# EAGLE design MBHP_CORE_LPC17v1.5.1 (EAGLE 6.5.0)

## Sheet 1 of 2: CORE
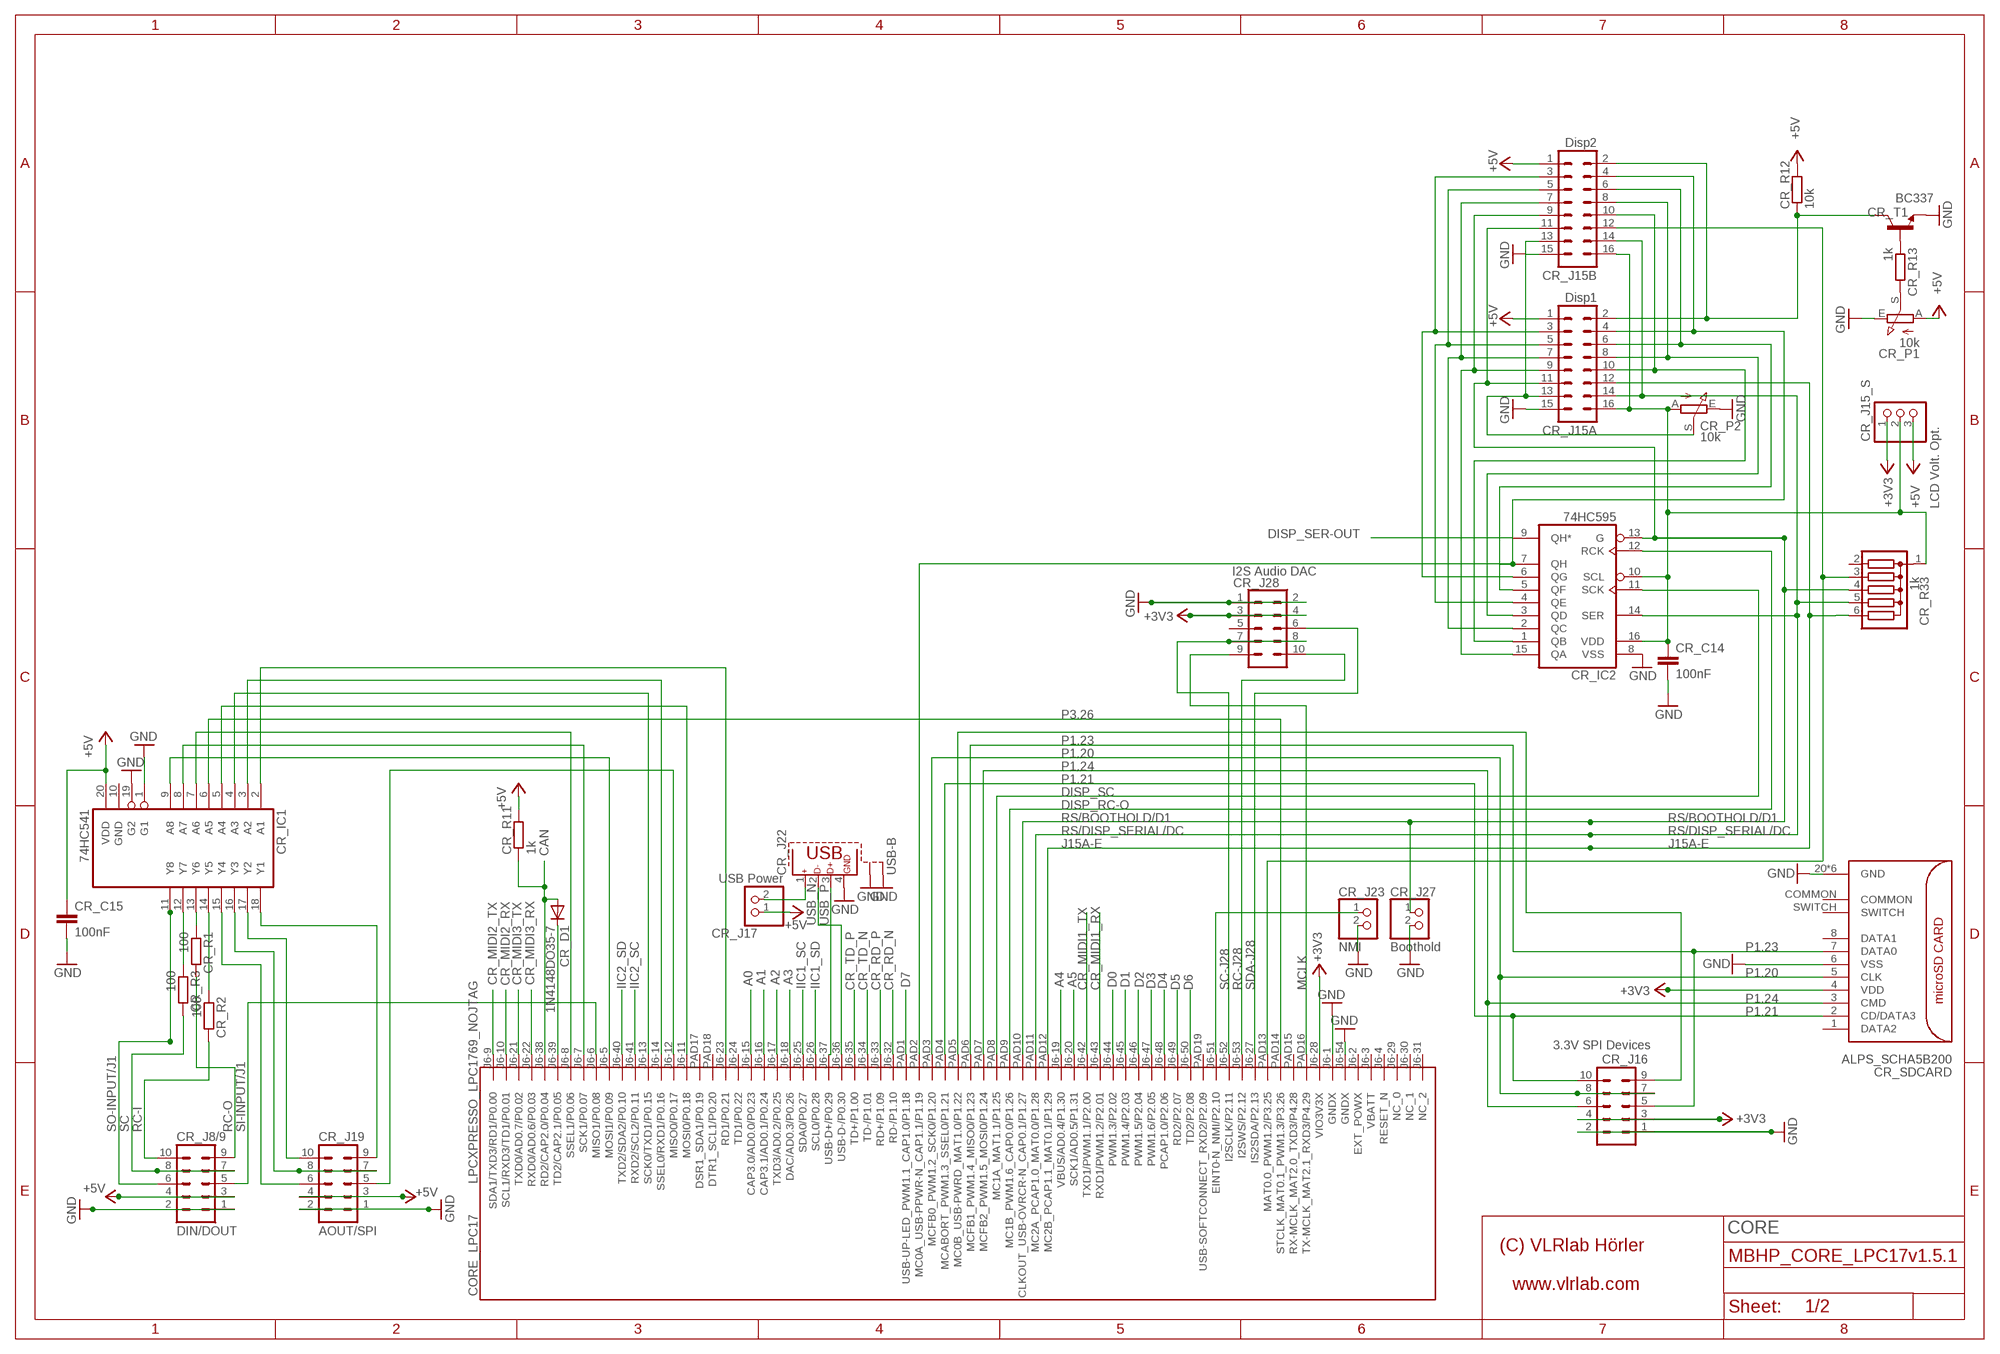
[diagram p0: schematic, sheet 1]

### Parts
CORE_LPC17  LPCXPRESSO_LPC1769_NOJTAG  [LPCEXPRESSO_CUT_NOJTAG]
CR_C14  100nF  C5/3  [C5B3]
CR_C15  100nF  C5/3  [C5B3]
CR_D1  1N4148DO35-7  [DO35-7]
CR_IC1  74HC541  [DIL20]
CR_IC2  74HC595  [DIL16]
CR_J8/9  DIN/DOUT  ML10  [ML10]
CR_J15_S  LCD Volt. Opt.  PINHD-1X3  [1X03]
CR_J15A  Disp1  ML16  [ML16]
CR_J15B  Disp2  ML16  [ML16]
CR_J16  3.3V SPI Devices  ML10  [ML10]
CR_J17  USB Power  PINHD-1X2  [1X02]
CR_J19  AOUT/SPI  ML10  [ML10]
CR_J22  USB-B  [USB-B]
CR_J23  NMI  PINHD-1X2  [1X02]
CR_J27  Boothold  PINHD-1X2  [1X02]
CR_J28  I2S Audio DAC  ML10  [ML10]
CR_P1  10k  PHIER_6MM  [6MM_V]
CR_P2  10k  PHIER_6MM  [6MM_V]
CR_R1  100  R-EU_0204/7  [0204/7]
CR_R2  100  R-EU_0204/7  [0204/7]
CR_R3  100  R-EU_0204/7  [0204/7]
CR_R11  1k  R-EU_0204/7  [0204/7]
CR_R12  10k  R-EU_0204/7  [0204/7]
CR_R13  1k  R-EU_0204/7  [0204/7]
CR_R33  1k  4306R  [SIL6]
CR_SDCARD  ALPS_SCHA5B200  [ALPS_SCHA5B0200_MICRO_SD_PUSHPUSH]
CR_T1  BC337  [TO92]

### Nets
+3V3 [SDcard]: CORE_LPC17.J6-28(VIO3V3X) CR_J15_S.1 CR_J16.3 CR_J16.4 CR_J28.3 CR_J28.4 CR_SDCARD.4(VDD) ; also sheet 2
+5V [VDD]: CR_C15.1 CR_IC1.20(VDD) CR_J8/9.3 CR_J8/9.4 CR_J15_S.3 CR_J15A.1 CR_J15B.1 CR_J17.1 CR_J19.3 CR_J19.4 CR_P1.A CR_R11.2 CR_R12.2 ; also sheet 2
A0: CORE_LPC17.J6-15(CAP3.0/AD0.0/P0.23) ; also sheet 2
A1: CORE_LPC17.J6-16(CAP3.1/AD0.1/P0.24) ; also sheet 2
A2: CORE_LPC17.J6-17(TXD3/AD0.2/P0.25) ; also sheet 2
A3: CORE_LPC17.J6-18(DAC/AD0.3/P0.26) ; also sheet 2
A4: CORE_LPC17.J6-19(VBUS/AD0.4/P1.30) ; also sheet 2
A5: CORE_LPC17.J6-20(SCK1/AD0.5/P1.31) ; also sheet 2
CAN: CORE_LPC17.J6-38(RD2/CAP2.0/P0.04) CR_D1.A CR_R11.1 ; also sheet 2
CR_MIDI1_RX: CORE_LPC17.J6-43(RXD1/PWM1.2/P2.01) ; also sheet 2
CR_MIDI1_TX: CORE_LPC17.J6-42(TXD1/PWM1.1/P2.00) ; also sheet 2
CR_MIDI2_RX: CORE_LPC17.J6-10(SCL1/RXD3/TD1/P0.01) ; also sheet 2
CR_MIDI2_TX: CORE_LPC17.J6-9(SDA1/TXD3/RD1/P0.00) ; also sheet 2
CR_MIDI3_RX: CORE_LPC17.J6-22(RXD0/AD0.6/P0.03) ; also sheet 2
CR_MIDI3_TX: CORE_LPC17.J6-21(TXD0/AD0.7/P0.02) ; also sheet 2
CR_RD_N: CORE_LPC17.J6-32(RD-/P1.10) ; also sheet 2
CR_RD_P: CORE_LPC17.J6-33(RD+/P1.09) ; also sheet 2
CR_TD_N: CORE_LPC17.J6-34(TD-/P1.01) ; also sheet 2
CR_TD_P: CORE_LPC17.J6-35(TD+/P1.00) ; also sheet 2
D0: CORE_LPC17.J6-44(PWM1.3/P2.02) ; also sheet 2
D1: CORE_LPC17.J6-45(PWM1.4/P2.03) ; also sheet 2
D2: CORE_LPC17.J6-46(PWM1.5/P2.04) ; also sheet 2
D3: CORE_LPC17.J6-47(PWM1.6/P2.05) ; also sheet 2
D4: CORE_LPC17.J6-48(PCAP1.0/P2.06) ; also sheet 2
D5: CORE_LPC17.J6-49(RD2/P2.07) ; also sheet 2
D6: CORE_LPC17.J6-50(TD2/P2.08) ; also sheet 2
D7: CORE_LPC17.PAD1(USB-UP-LED_PWM1.1_CAP1.0/P1.18) ; also sheet 2
DISP_RC-O: CORE_LPC17.PAD9(MC1B_PWM1.6_CAP0.0/P1.26) CR_IC2.12(RCK)
DISP_SC: CORE_LPC17.PAD8(MC1A_MAT1.1/P1.25) CR_IC2.11(SCK)
DISP_SER-OUT: CR_IC2.9(QH*)
GND: CORE_LPC17.J6-1(GNDX) CORE_LPC17.J6-54(GNDX) CR_C14.2 CR_C15.2 CR_IC1.1(G1) CR_IC1.19(G2) CR_IC2.8(VSS) CR_J8/9.1 CR_J8/9.2 CR_J15A.15 CR_J15B.15 CR_J16.1 CR_J16.2 CR_J19.1 CR_J19.2 CR_J22.4 CR_J22.S1 CR_J22.S2 CR_J23.2 CR_J27.2 CR_J28.1 CR_J28.2 CR_P1.E CR_P2.E CR_SDCARD.6(VSS) CR_SDCARD.20(GND) CR_SDCARD.21(GND) CR_SDCARD.22(GND) CR_SDCARD.23(GND) CR_SDCARD.24(GND) CR_SDCARD.25(GND) CR_T1.1(E) ; also sheet 2
IIC1_SC: CORE_LPC17.J6-25(SDA0/P0.27) ; also sheet 2
IIC1_SD: CORE_LPC17.J6-26(SCL0/P0.28) ; also sheet 2
IIC2_SC: CORE_LPC17.J6-41(RXD2/SCL2/P0.11) ; also sheet 2
IIC2_SD: CORE_LPC17.J6-40(TXD2/SDA2/P0.10) ; also sheet 2
J15A-E: CORE_LPC17.PAD12(MC2B_PCAP1.1_MAT0.1/P1.29) CR_J15A.12 CR_R33.6
J15B-E2: CORE_LPC17.PAD13(MAT0.0_PWM1.2/P3.25) CR_J15B.12 CR_R33.3 ; also sheet 2
LCD_VOLTAGE_OPTION [VDD]: CR_C14.1 CR_IC2.10(SCL) CR_IC2.16(VDD) CR_J15_S.2 CR_J15A.16 CR_J15B.16 CR_P2.A CR_R33.1 ; also sheet 2
MCLK: CORE_LPC17.PAD16(TX-MCLK_MAT2.1_RXD3/P4.29) CR_J28.9
N$1: CR_IC2.6(QG) CR_J15A.3 CR_J15B.3
N$2: CR_IC2.5(QF) CR_J15A.6 CR_J15B.6
N$3: CR_IC2.4(QE) CR_J15A.5 CR_J15B.5
N$4: CR_IC2.3(QD) CR_J15A.8 CR_J15B.8
N$6: CORE_LPC17.J6-39(TD2/CAP2.1/P0.05) CR_D1.C
N$8: CR_IC2.2(QC) CR_J15A.7 CR_J15B.7
N$9: CR_IC2.1(QB) CR_J15A.10 CR_J15B.10
N$10: CR_IC2.15(QA) CR_J15A.9 CR_J15B.9
N$11: CORE_LPC17.J6-51(EINT0-N_NMI/P2.10) CR_J23.1
N$12: CR_J15A.13 CR_J15B.13 CR_P2.S
N$13: CR_IC1.15(Y4) CR_J19.6
N$14: CR_P1.S CR_R13.2
N$15: CR_R13.1 CR_T1.2(B)
N$18: CR_J15A.2 CR_J15B.2 CR_R12.1 CR_T1.3(C)
N$20: CR_IC1.17(Y2) CR_J19.10
N$21: CR_IC1.18(Y1) CR_J19.9
N$22: CR_IC1.16(Y3) CR_J19.7 CR_J19.8
N$23: CORE_LPC17.J6-12(MISO0/P0.17) CR_J19.5
N$27: CORE_LPC17.PAD5(MC0B_USB-PWRD_MAT1.0/P1.22) CR_J16.9
N$37: CR_J17.2 CR_J22.1
N$67: CORE_LPC17.PAD2(MC0A_USB-PPWR-N_CAP1.1/P1.19) CR_IC2.7(QH) CR_J15A.4 CR_J15B.4
N$89: CORE_LPC17.J6-14(SSEL0/RXD1/P0.16) CR_IC1.3(A2)
N$90: CORE_LPC17.J6-23(RD1/P0.21) CR_IC1.2(A1)
N$91: CORE_LPC17.J6-13(SCK0/TXD1/P0.15) CR_IC1.4(A3)
N$92: CORE_LPC17.J6-11(MOSI0/P0.18) CR_IC1.5(A4)
N$94: CORE_LPC17.J6-8(SSEL1/P0.06) CR_IC1.7(A6)
N$95: CORE_LPC17.J6-7(SCK1/P0.07) CR_IC1.8(A7)
N$96: CORE_LPC17.J6-5(MOSI1/P0.09) CR_IC1.9(A8)
P1.20: CORE_LPC17.PAD3(MCFB0_PWM1.2_SCK0/P1.20) CR_J16.7 CR_J16.8 CR_SDCARD.5(CLK)
P1.21: CORE_LPC17.PAD4(MCABORT_PWM1.3_SSEL0/P1.21) CR_J16.10 CR_SDCARD.2(CD/DATA3)
P1.23: CORE_LPC17.PAD6(MCFB1_PWM1.4_MISO0/P1.23) CR_J16.5 CR_SDCARD.7(DATA0)
P1.24: CORE_LPC17.PAD7(MCFB2_PWM1.5_MOSI0/P1.24) CR_J16.6 CR_SDCARD.3(CMD)
P3.26: CORE_LPC17.PAD14(STCLK_MAT0.1_PWM1.3/P3.26) CR_IC1.6(A5)
RC-I: CR_J8/9.10 CR_R2.2
RC-I-: CR_IC1.14(Y5) CR_R2.1
RC-J28: CORE_LPC17.J6-53(I2SWS/P2.12) CR_J28.10 ; also sheet 2
RC-O: CR_J8/9.9 CR_R1.2
RC-O-: CR_IC1.13(Y6) CR_R1.1
RS/BOOTHOLD/D1: CORE_LPC17.PAD10(CLKOUT_USB-OVRCR-N_CAP0.1/P1.27) CR_IC2.13(G) CR_J15A.11 CR_J15B.11 CR_J27.1 CR_R33.4 ; also sheet 2
RS/DISP_SERIAL/DC: CORE_LPC17.PAD11(MC2A_PCAP1.0_MAT0.0/P1.28) CR_IC2.14(SER) CR_J15A.14 CR_J15B.14 CR_R33.5 ; also sheet 2
SC: CR_J8/9.7 CR_J8/9.8 CR_R3.2
SC-: CR_IC1.12(Y7) CR_R3.1
SC-J28: CORE_LPC17.J6-52(I2SCLK/P2.11) CR_J28.7 CR_J28.8 ; also sheet 2
SDA-J28: CORE_LPC17.J6-27(IS2SDA/P2.13) CR_J28.6 ; also sheet 2
SI-INPUT/J1: CORE_LPC17.J6-6(MISO1/P0.08) CR_J8/9.5
SO-INPUT/J1: CR_IC1.11(Y8) CR_J8/9.6
USB_N: CORE_LPC17.J6-36(USB-D-/P0.30) CR_J22.2
USB_P: CORE_LPC17.J6-37(USB-D+/P0.29) CR_J22.3
Unconnected: CORE_LPC17.J6-2(EXT_POWX) CORE_LPC17.J6-3(VBATT) CORE_LPC17.J6-4(RESET_N) CORE_LPC17.J6-24(TD1/P0.22) CORE_LPC17.J6-29(NC_0) CORE_LPC17.J6-30(NC_1) CORE_LPC17.J6-31(NC_2) CORE_LPC17.PAD15(RX-MCLK_MAT2.0_TXD3/P4.28) CORE_LPC17.PAD17(DSR1_SDA1/P0.19) CORE_LPC17.PAD18(DTR1_SCL1/P0.20) CORE_LPC17.PAD19(USB-SOFTCONNECT_RXD2/P2.09) CR_J28.5 CR_R33.2 CR_SDCARD.1(DATA2) CR_SDCARD.8(DATA1) CR_SDCARD.COMMON CR_SDCARD.SWITCH

### Notes on the sheet
- CORE

## Sheet 2 of 2: Supp&Con
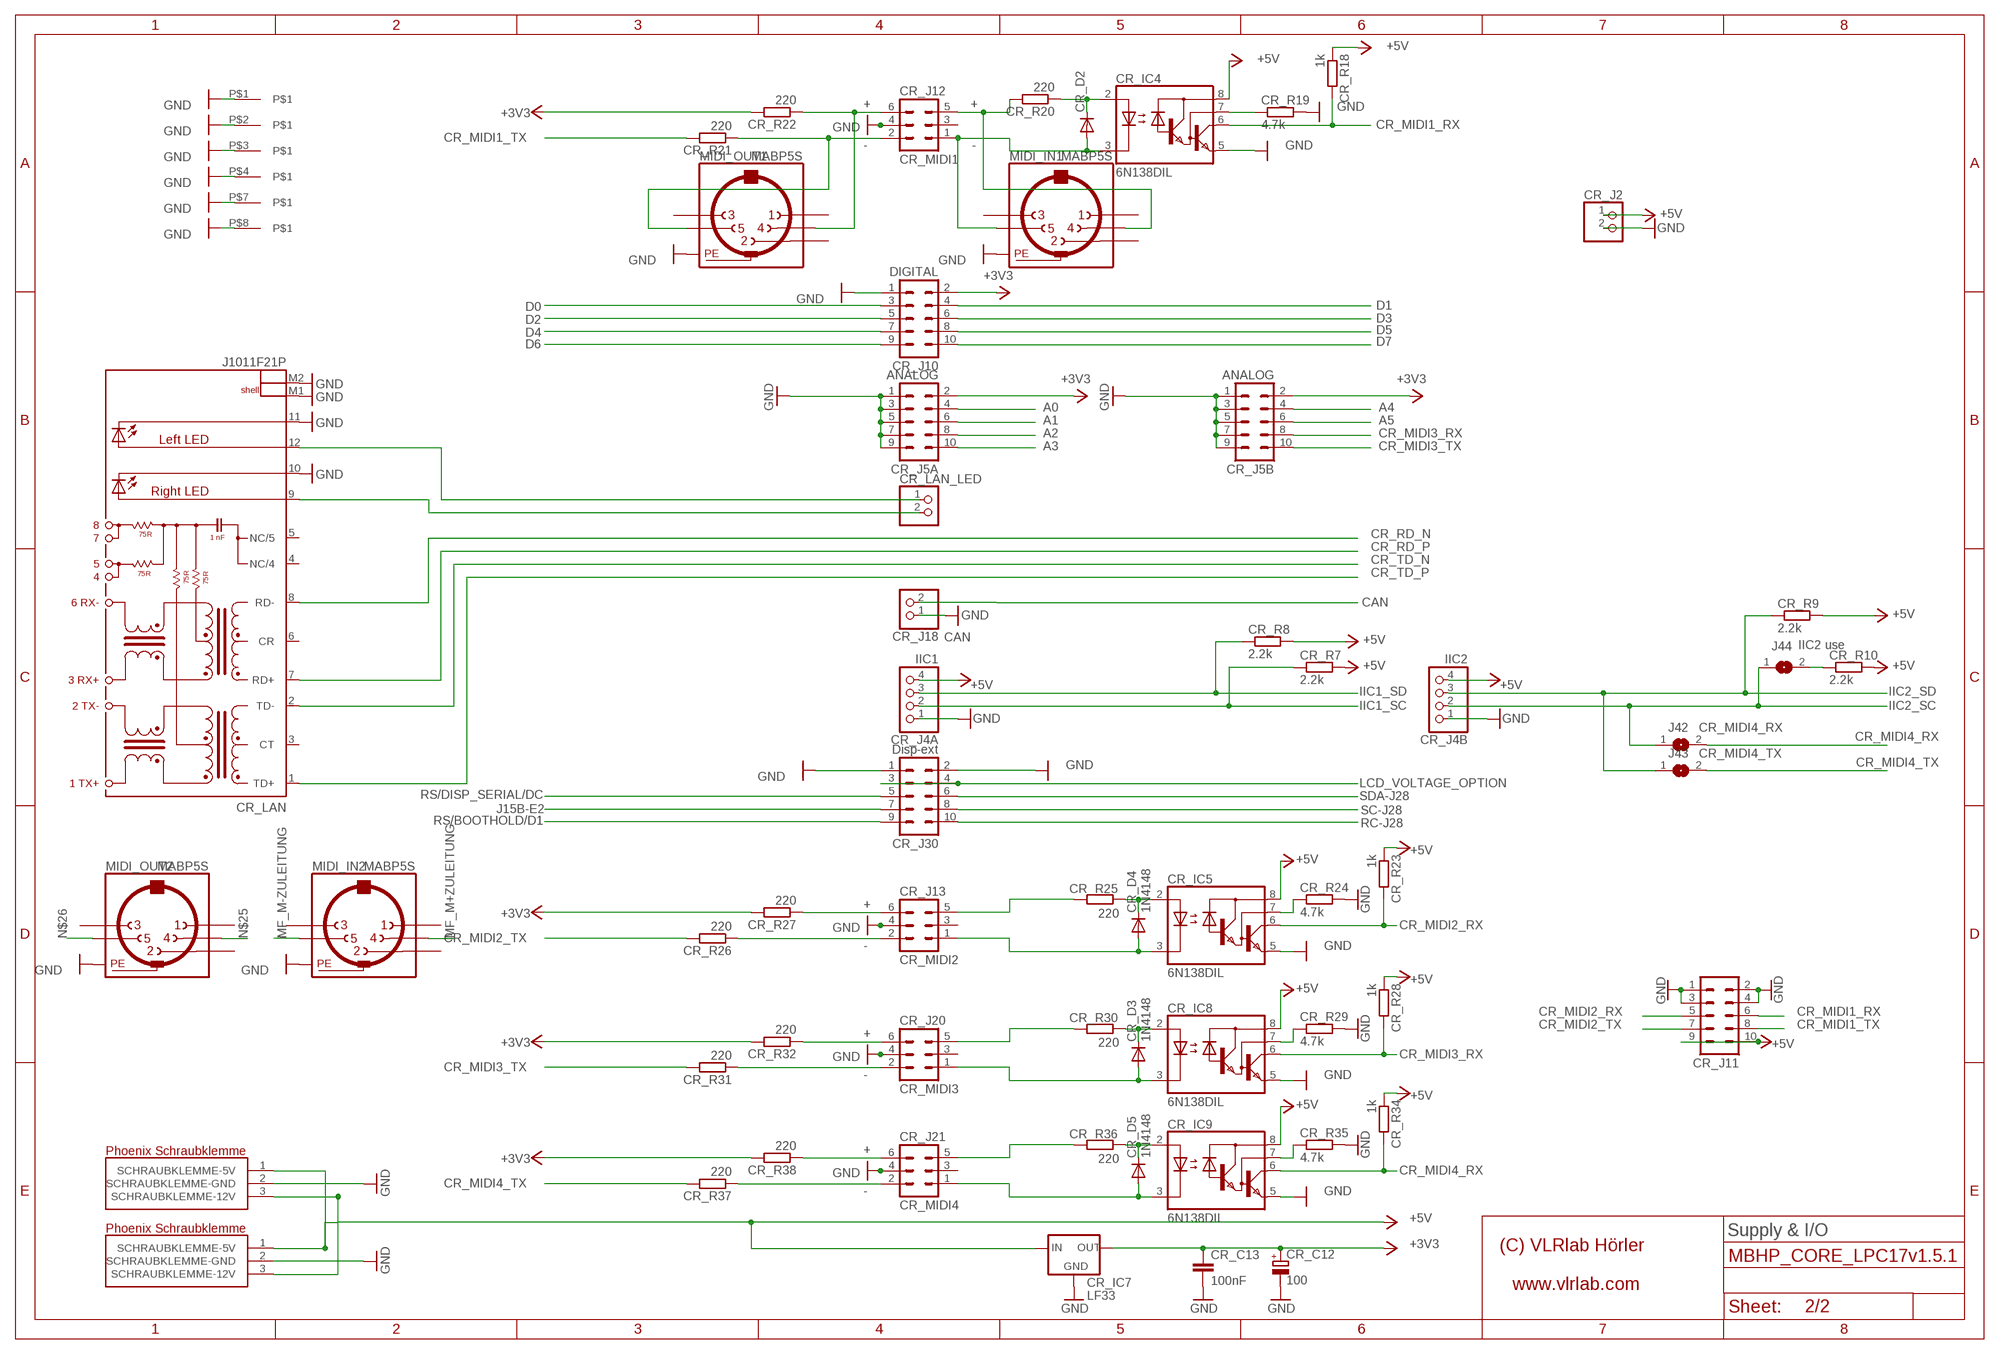
[diagram p1: schematic, sheet 2]

### Parts
CR_C12  100  CPOL-EUE5-10.5  [E5-10,5]
CR_C13  100nF  C5/3  [C5B3]
CR_D2  1N4148DO35-7  [DO35-7]
CR_D3  1N4148  1N4148DO35-7  [DO35-7]
CR_D4  1N4148  1N4148DO35-7  [DO35-7]
CR_D5  1N4148  1N4148DO35-7  [DO35-7]
CR_IC4  6N138DIL  [DIL08]
CR_IC5  6N138DIL  [DIL08]
CR_IC7  LF33  [TO220]
CR_IC8  6N138DIL  [DIL08]
CR_IC9  6N138DIL  [DIL08]
CR_J2  PINHD-1X2  [1X02]
CR_J4A  IIC1  PINHD-1X4  [1X04]
CR_J4B  IIC2  PINHD-1X4  [1X04]
CR_J5A  ANALOG  ML10  [ML10]
CR_J5B  ANALOG  ML10  [ML10]
CR_J10  DIGITAL  ML10  [ML10]
CR_J11  ML10  [ML10]
CR_J12  CR_MIDI1  ML6  [ML6]
CR_J13  CR_MIDI2  ML6  [ML6]
CR_J18  CAN  PINHD-1X2  [1X02]
CR_J20  CR_MIDI3  ML6  [ML6]
CR_J21  CR_MIDI4  ML6  [ML6]
CR_J30  Disp-ext  ML10  [ML10]
CR_LAN  J1011F21P  [J1]
CR_LAN_LED  PINHD-1X2  [1X02]
CR_R7  2.2k  R-EU_0204/7  [0204/7]
CR_R8  2.2k  R-EU_0204/7  [0204/7]
CR_R9  2.2k  R-EU_0204/7  [0204/7]
CR_R10  2.2k  R-EU_0204/7  [0204/7]
CR_R18  1k  R-EU_0204/7  [0204/7]
CR_R19  4.7k  R-EU_0204/7  [0204/7]
CR_R20  220  R-EU_0204/7  [0204/7]
CR_R21  220  R-EU_0204/7  [0204/7]
CR_R22  220  R-EU_0204/7  [0204/7]
CR_R23  1k  R-EU_0204/7  [0204/7]
CR_R24  4.7k  R-EU_0204/7  [0204/7]
CR_R25  220  R-EU_0204/7  [0204/7]
CR_R26  220  R-EU_0204/7  [0204/7]
CR_R27  220  R-EU_0204/7  [0204/7]
CR_R28  1k  R-EU_0204/7  [0204/7]
CR_R29  4.7k  R-EU_0204/7  [0204/7]
CR_R30  220  R-EU_0204/7  [0204/7]
CR_R31  220  R-EU_0204/7  [0204/7]
CR_R32  220  R-EU_0204/7  [0204/7]
CR_R34  1k  R-EU_0204/7  [0204/7]
CR_R35  4.7k  R-EU_0204/7  [0204/7]
CR_R36  220  R-EU_0204/7  [0204/7]
CR_R37  220  R-EU_0204/7  [0204/7]
CR_R38  220  R-EU_0204/7  [0204/7]
J42  CR_MIDI4_RX  SJ  [SJ]
J43  CR_MIDI4_TX  SJ  [SJ]
J44  IIC2 use  SJ  [SJ]
KLEMME1  PT-1.5/3  [PT-1.5/3-5.0]
KLEMME2  PT-1.5/3  [PT-1.5/3-5.0]
MIDI_IN1  MABP5S  [MABP5S]
MIDI_IN2  MABP5S  [MABP5S]
MIDI_OUT1  MABP5S  [MABP5S]
MIDI_OUT2  MABP5S  [MABP5S]
U$2  MIDIBOX_FULL  [MIDIBOX14X12]

### Nets
+3V3 [SDcard]: CR_C12.+ CR_C13.1 CR_IC7.OUT CR_J5A.2 CR_J5B.2 CR_J10.2 CR_R22.2 CR_R27.2 CR_R32.2 CR_R38.2 ; also sheet 1
+5V [VDD]: CR_IC4.8(VCC) CR_IC5.8(VCC) CR_IC7.IN CR_IC8.8(VCC) CR_IC9.8(VCC) CR_J2.1 CR_J4A.4 CR_J4B.4 CR_J11.9 CR_J11.10 CR_R7.2 CR_R8.2 CR_R9.2 CR_R10.2 CR_R18.1 CR_R23.1 CR_R28.1 CR_R34.1 KLEMME1.1(SCHRAUBKLEMME-5V) KLEMME2.1(SCHRAUBKLEMME-5V) ; also sheet 1
+12V [10V]: KLEMME1.3(SCHRAUBKLEMME-12V) KLEMME2.3(SCHRAUBKLEMME-12V)
A0: CR_J5A.4 ; also sheet 1
A1: CR_J5A.6 ; also sheet 1
A2: CR_J5A.8 ; also sheet 1
A3: CR_J5A.10 ; also sheet 1
A4: CR_J5B.4 ; also sheet 1
A5: CR_J5B.6 ; also sheet 1
CAN: CR_J18.2 ; also sheet 1
CR_LEFT_LED: CR_LAN.12(AL) CR_LAN_LED.1
CR_M1+: CR_J12.5 CR_R20.2 MIDI_IN1.4
CR_M1-: CR_D2.A CR_IC4.3(C) CR_J12.1 MIDI_IN1.5
CR_M2+$1: CR_D2.C CR_IC4.2(A) CR_R20.1
CR_MIDI1_RX: CR_IC4.6(VO) CR_J11.6 CR_R18.2 ; also sheet 1
CR_MIDI1_TX: CR_J11.8 CR_R21.2 ; also sheet 1
CR_MIDI2_RX: CR_IC5.6(VO) CR_J11.5 CR_R23.2 ; also sheet 1
CR_MIDI2_TX: CR_J11.7 CR_R26.2 ; also sheet 1
CR_MIDI3_RX: CR_IC8.6(VO) CR_J5B.8 CR_R28.2 ; also sheet 1
CR_MIDI3_TX: CR_J5B.10 CR_R31.2 ; also sheet 1
CR_MIDI4_RX: CR_IC9.6(VO) CR_R34.2 J42.2
CR_MIDI4_TX: CR_R37.2 J43.2
CR_RD_N: CR_LAN.8(RD-) ; also sheet 1
CR_RD_P: CR_LAN.7(RD+) ; also sheet 1
CR_RIGHT_LED: CR_LAN.9(A-R) CR_LAN_LED.2
CR_TD_N: CR_LAN.2(TD-) ; also sheet 1
CR_TD_P: CR_LAN.1(TD+) ; also sheet 1
D0: CR_J10.3 ; also sheet 1
D1: CR_J10.4 ; also sheet 1
D2: CR_J10.5 ; also sheet 1
D3: CR_J10.6 ; also sheet 1
D4: CR_J10.7 ; also sheet 1
D5: CR_J10.8 ; also sheet 1
D6: CR_J10.9 ; also sheet 1
D7: CR_J10.10 ; also sheet 1
GND: CR_C12.- CR_C13.2 CR_IC4.5(GND) CR_IC5.5(GND) CR_IC7.GND CR_IC8.5(GND) CR_IC9.5(GND) CR_J2.2 CR_J4A.1 CR_J4B.1 CR_J5A.1 CR_J5A.3 CR_J5A.5 CR_J5A.7 CR_J5A.9 CR_J5B.1 CR_J5B.3 CR_J5B.5 CR_J5B.7 CR_J5B.9 CR_J10.1 CR_J11.1 CR_J11.2 CR_J11.3 CR_J11.4 CR_J12.4 CR_J13.4 CR_J18.1 CR_J20.4 CR_J21.4 CR_J30.1 CR_J30.2 CR_LAN.10(C-R) CR_LAN.11(C-L) CR_LAN.M1(AL1) CR_LAN.M2(AL2) CR_R19.2 CR_R24.2 CR_R29.2 CR_R35.2 KLEMME1.2(SCHRAUBKLEMME-GND) KLEMME2.2(SCHRAUBKLEMME-GND) MIDI_IN1.PE MIDI_IN1.PE@(PE) MIDI_IN2.PE MIDI_IN2.PE@(PE) MIDI_OUT1.PE MIDI_OUT1.PE@(PE) MIDI_OUT2.PE MIDI_OUT2.PE@(PE) U$2.P$1 U$2.P$2 U$2.P$3 U$2.P$4 U$2.P$7 U$2.P$8 ; also sheet 1
IIC1_SC: CR_J4A.2 CR_R7.1 ; also sheet 1
IIC1_SD: CR_J4A.3 CR_R8.1 ; also sheet 1
IIC2_SC: CR_J4B.2 J42.1 J44.1 ; also sheet 1
IIC2_SD: CR_J4B.3 CR_R9.1 J43.1 ; also sheet 1
J15B-E2: CR_J30.7 ; also sheet 1
LCD_VOLTAGE_OPTION [VDD]: CR_J30.3 CR_J30.4 ; also sheet 1
MF_M+ZULEITUNG: CR_J13.5 CR_R25.2 MIDI_IN2.4
MF_M+ZULEITUNG1: CR_J20.5 CR_R30.2
MF_M+ZULEITUNG2: CR_J21.5 CR_R36.2
MF_M-ZULEITUNG: CR_D4.A CR_IC5.3(C) CR_J13.1 MIDI_IN2.5
MF_M-ZULEITUNG1: CR_D3.A CR_IC8.3(C) CR_J20.1
MF_M-ZULEITUNG2: CR_D5.A CR_IC9.3(C) CR_J21.1
N$5: CR_J12.6 CR_R22.1 MIDI_OUT1.4
N$7: CR_IC4.7(VB) CR_R19.1
N$19: CR_D4.C CR_IC5.2(A) CR_R25.1
N$24: CR_J12.3
N$25: CR_J13.6 CR_R27.1 MIDI_OUT2.4
N$26: CR_J13.2 CR_R26.1 MIDI_OUT2.5
N$28: CR_D3.C CR_IC8.2(A) CR_R30.1
N$29: CR_IC8.7(VB) CR_R29.1
N$30: CR_J20.6 CR_R32.1
N$31: CR_J20.2 CR_R31.1
N$32: CR_D5.C CR_IC9.2(A) CR_R36.1
N$33: CR_IC9.7(VB) CR_R35.1
N$34: CR_J21.6 CR_R38.1
N$35: CR_J21.2 CR_R37.1
N$36: CR_R10.1 J44.2
N$81: CR_J12.2 CR_R21.1 MIDI_OUT1.5
N$99: CR_IC5.7(VB) CR_R24.1
RC-J28: CR_J30.10 ; also sheet 1
RS/BOOTHOLD/D1: CR_J30.9 ; also sheet 1
RS/DISP_SERIAL/DC: CR_J30.5 ; also sheet 1
SC-J28: CR_J30.8 ; also sheet 1
SDA-J28: CR_J30.6 ; also sheet 1
Unconnected: CR_J13.3 CR_J20.3 CR_J21.3 CR_LAN.3(CT) CR_LAN.4(NC/4) CR_LAN.5(NC/5) CR_LAN.6(CR) MIDI_IN1.1 MIDI_IN1.2 MIDI_IN1.3 MIDI_IN2.1 MIDI_IN2.2 MIDI_IN2.3 MIDI_OUT1.1 MIDI_OUT1.2 MIDI_OUT1.3 MIDI_OUT2.1 MIDI_OUT2.2 MIDI_OUT2.3

### Notes on the sheet
- + | +
- - | -
- +
- -
- +
- -
- +
- -
- Supply & I/O

## Power pins joined to a net without a drawn wire
GND: CR_IC1.10(GND)

## Library data of the parts
CORE_LPC17 = LPC1769:LPCXPRESSO_LPC1769_NOJTAG: LPCXpresso LPC1769 RevB
CR_C12 = rcl:CPOL-EU: POLARIZED CAPACITOR, European symbol
CR_C13-CR_C15 = capacitor-wima:C: CAPACITOR naming: grid - package width
CR_D1-CR_D5 = diode:1N4148: DIODE high speed (Philips)
CR_IC1 = 595-541-165-uln2803:74HC541
CR_IC2 = 74-595:74HC595
CR_IC4 CR_IC5 CR_IC8 CR_IC9 = 6N138:6N138DIL
CR_IC7 = LF33:LF33
CR_J2 CR_J17 CR_J18 CR_J23 CR_J27 CR_LAN_LED = pinhead_Ivan:PINHD-1X2: PIN HEADER
CR_J4A CR_J4B = pinhead_Ivan:PINHD-1X4: PIN HEADER
CR_J5A CR_J5B CR_J8/9 CR_J10 CR_J11 CR_J16 CR_J19 CR_J28 CR_J30 = con-harting-ml:ML10: HARTING; OC_FARNELL: unknown; OC_NEWARK: unknown
CR_J12 CR_J13 CR_J20 CR_J21 = con-harting-ml:ML6: HARTING; OC_FARNELL: unknown; OC_NEWARK: unknown
CR_J15_S = pinhead_Ivan:PINHD-1X3: PIN HEADER
CR_J15A CR_J15B = con-ml:ML16: HARTING; OC_FARNELL: unknown; OC_NEWARK: unknown
CR_J22 = USB-B-S-RA Adam tech:USB-B
CR_LAN = con-pulse:J1011F: PULSEJACK (TM) 1x1 Tab-UP RJ45 10/100 Base-TX RJ45 1x1 Tab-UP with LEDs 8-pin (J1 series) and 6-pin (JP series) integrated magnetics connector, designed to support applications, such as ADSL modems, LAN-on-Motherboard, and Hub and Switches. Source: www.pulseeng.com .. PulseJack-J402.pdf; OC_FARNELL: unknown; OC_NEWARK: unknown
CR_P1 CR_P2 = Potentiometer 6mm:PHIER_6MM
CR_R1-CR_R3 CR_R7-CR_R10 = rcl:R-EU_: RESISTOR, European symbol
CR_R11-CR_R13 CR_R18-CR_R32 CR_R34-CR_R38 = resistor:R-EU_: RESISTOR, European symbol
CR_R33 = Bourns Resistor Array:4306R
CR_SDCARD = Micro SD:ALPS_SCHA5B200
CR_T1 = transistor:BC337: NPN TRANSISTOR
J42-J44 = jumper:SJ: SMD solder JUMPER
KLEMME1 KLEMME2 = Phonenix Contacts:PT-1.5/3
MIDI_IN1 MIDI_IN2 MIDI_OUT1 MIDI_OUT2 = midi:MABP5S
U$2 = Frames_VLR:MIDIBOX_FULL

## Net classes
0 default: width 0.254 mm, drill 0.33 mm, clearance 0.254 mm
1 VDD: width 1.016 mm, drill 0.33 mm, clearance 0.254 mm to class 0, clearance 0.254 mm
2 10V: width 1.016 mm, drill 0.33 mm, clearance 0.254 mm to class 0, clearance 0.254 mm to class 1, clearance 0.254 mm
3 SDcard: width 0.406 mm

## Board
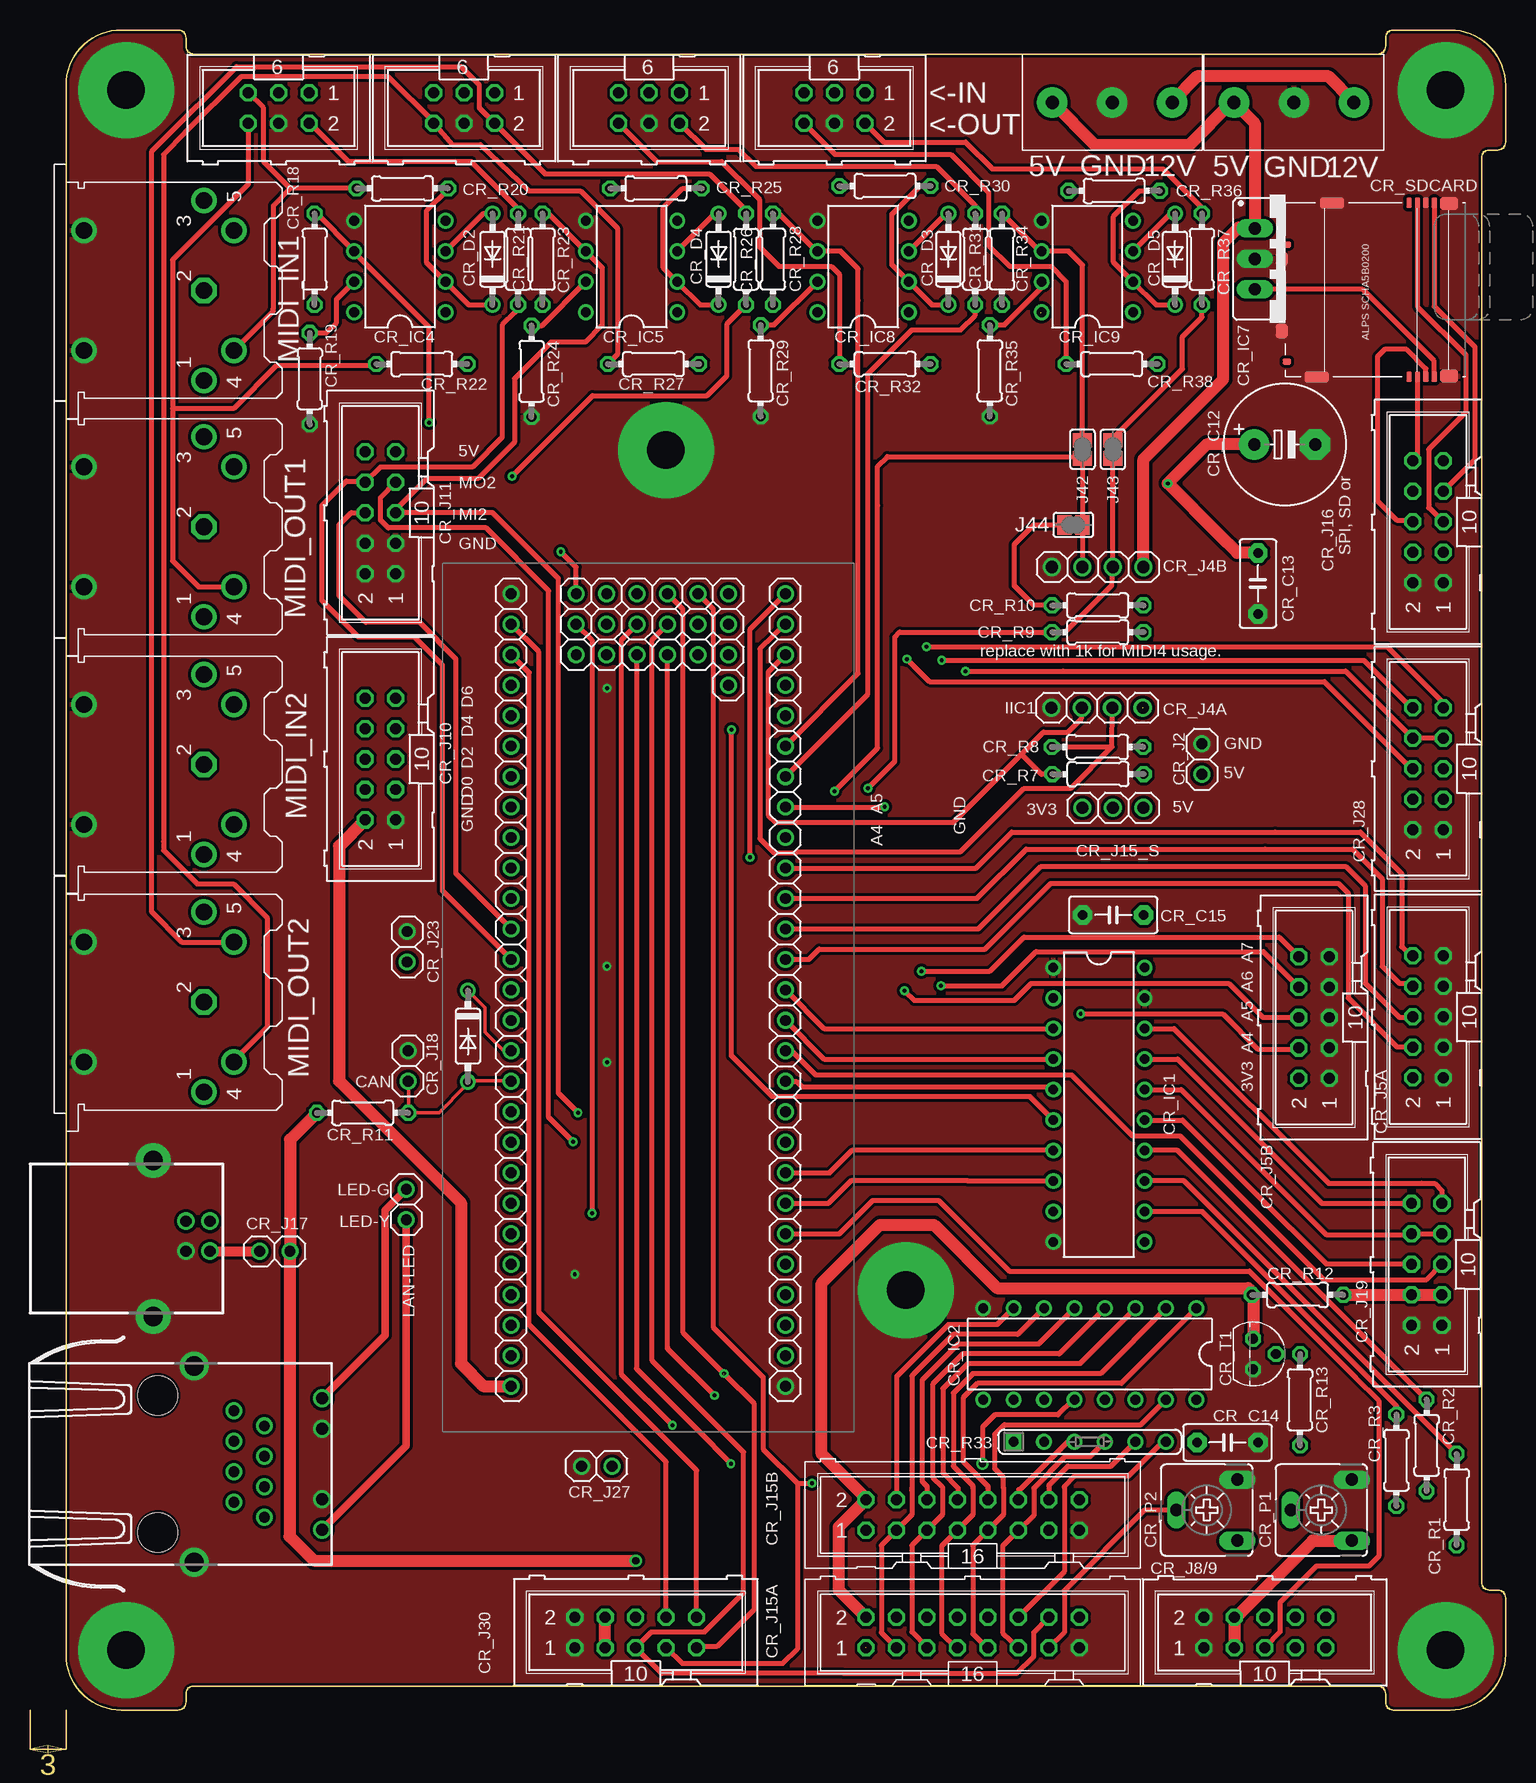
[diagram p2: board, top side]
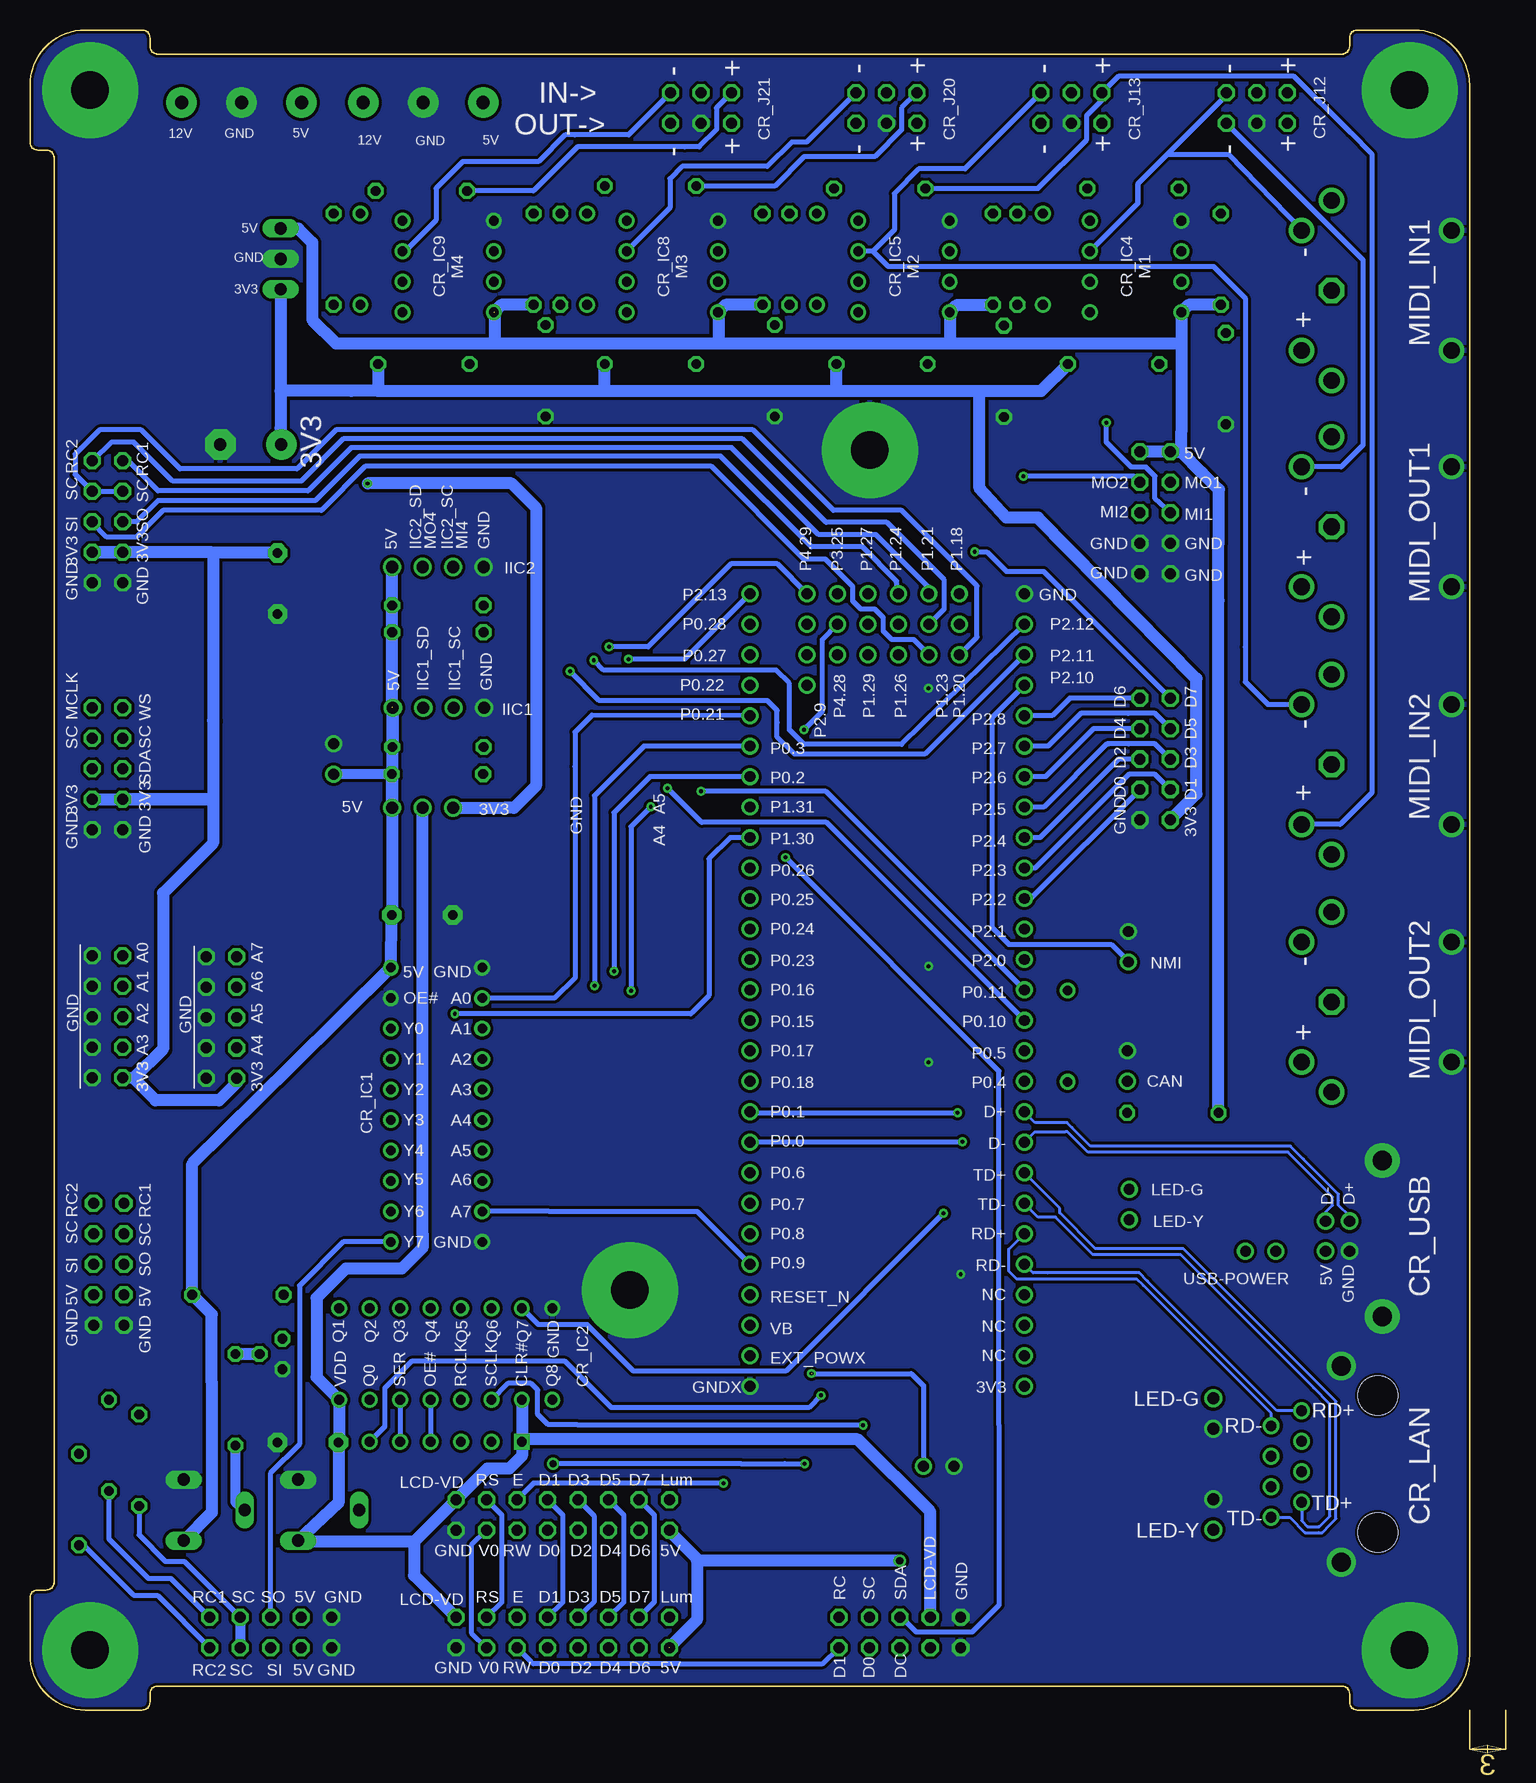
[diagram p3: board, bottom side, seen from below]

Size 120 x 140 mm. Coordinates in mm from the lower left corner, seen from the top.
Copper layers (1*16): Top 0.035mm / dielectric 1.5mm / Bottom 0.035mm
Design rules "makePCB *": minimum track width 10mil, minimum drill 24mil, track to track 8mil, track to pad 8mil, pad to pad 8mil, via to via 8mil, smd to smd 8mil, copper to edge 8mil, drill to drill 8mil, minimum pad ring 10mil, minimum via ring 8mil, stop-mask expansion 4mil, vias tented up to drill 0mil, thermal gap 0mil

### Footprints (pad centres in the part's own frame; a part is rotated, then mirrored left to right if it is on the bottom)
LPCEXPRESSO_CUT_NOJTAG = drill 0.9: J6-1 -31.75,-11.43; J6-2 -29.21,-11.43; J6-3 -26.67,-11.43; J6-4 -24.13,-11.43; J6-5 -21.59,-11.43; J6-6 -19.05,-11.43; J6-7 -16.51,-11.43; J6-8 -13.97,-11.43; J6-9 -11.43,-11.43; J6-10 -8.89,-11.43; J6-11 -6.35,-11.43; J6-12 -3.81,-11.43; J6-13 -1.27,-11.43; J6-14 1.27,-11.43; J6-15 3.81,-11.43; J6-16 6.35,-11.43; J6-17 8.89,-11.43; J6-18 11.43,-11.43; J6-19 13.97,-11.43; J6-20 16.51,-11.43; J6-21 19.05,-11.43; J6-22 21.59,-11.43; J6-23 24.13,-11.43; J6-24 26.67,-11.43; J6-25 29.21,-11.43; J6-26 31.75,-11.43; J6-27 34.29,-11.43; J6-28 -31.75,11.43; J6-29 -29.21,11.43; J6-30 -26.67,11.43; J6-31 -24.13,11.43; J6-32 -21.59,11.43; J6-33 -19.05,11.43; J6-34 -16.51,11.43; J6-35 -13.97,11.43; J6-36 -11.43,11.43; J6-37 -8.89,11.43; J6-38 -6.35,11.43; J6-39 -3.81,11.43; J6-40 -1.27,11.43; J6-41 1.27,11.43; J6-42 3.81,11.43; J6-43 6.35,11.43; J6-44 8.89,11.43; J6-45 11.43,11.43; J6-46 13.97,11.43; J6-47 16.51,11.43; J6-48 19.05,11.43; J6-49 21.59,11.43; J6-50 24.13,11.43; J6-51 26.67,11.43; J6-52 29.21,11.43; J6-53 31.75,11.43; J6-54 34.29,11.43; PAD1 34.29,6.01; PAD2 31.75,6.02; PAD3 29.21,6.01; PAD4 34.29,3.47; PAD5 31.75,3.485; PAD6 29.21,3.485; PAD7 34.29,0.945; PAD8 31.75,0.945; PAD9 29.21,0.945; PAD10 34.29,-1.595; PAD11 31.75,-1.595; PAD12 29.21,-1.595; PAD13 34.29,-4.135; PAD14 31.75,-4.135; PAD15 29.21,-4.135; PAD16 34.29,-6.675; PAD17 31.75,-6.675; PAD18 29.21,-6.675; PAD19 26.67,-6.675
E5-10,5 = drill 1.016 pad 2.54: + -2.54,0 | drill 1.016 pad 2.54 octagon: - 2.54,0
C5B3 = drill 0.813 pad 1.6 octagon: 1 -2.54,0; 2 2.54,0
DO35-7 = drill 0.813: A 3.81,0; C -3.81,0
DIL20 = drill 0.813: 1 -11.43,-3.81; 2 -8.89,-3.81; 3 -6.35,-3.81; 4 -3.81,-3.81; 5 -1.27,-3.81; 6 1.27,-3.81; 7 3.81,-3.81; 8 6.35,-3.81; 9 8.89,-3.81; 10 11.43,-3.81; 11 11.43,3.81; 12 8.89,3.81; 13 6.35,3.81; 14 3.81,3.81; 15 1.27,3.81; 16 -1.27,3.81; 17 -3.81,3.81; 18 -6.35,3.81; 19 -8.89,3.81; 20 -11.43,3.81
DIL16 = drill 0.813: 1 -8.89,-3.81; 2 -6.35,-3.81; 3 -3.81,-3.81; 4 -1.27,-3.81; 5 1.27,-3.81; 6 3.81,-3.81; 7 6.35,-3.81; 8 8.89,-3.81; 9 8.89,3.81; 10 6.35,3.81; 11 3.81,3.81; 12 1.27,3.81; 13 -1.27,3.81; 14 -3.81,3.81; 15 -6.35,3.81; 16 -8.89,3.81
DIL08 = drill 0.813: 1 -3.81,-3.81; 2 -1.27,-3.81; 3 1.27,-3.81; 4 3.81,-3.81; 5 3.81,3.81; 6 1.27,3.81; 7 -1.27,3.81; 8 -3.81,3.81
TO220 = drill 1.016 long: GND 0,0; IN -2.54,0; OUT 2.54,0
1X02 = drill 0.9: 1 -1.27,0; 2 1.27,0
1X04 = drill 1.016: 1 -3.81,0; 2 -1.27,0; 3 1.27,0; 4 3.81,0
ML10 = drill 0.914 octagon: 1 -5.08,-1.27; 2 -5.08,1.27; 3 -2.54,-1.27; 4 -2.54,1.27; 5 0,-1.27; 6 0,1.27; 7 2.54,-1.27; 8 2.54,1.27; 9 5.08,-1.27; 10 5.08,1.27
ML6 = drill 0.914 octagon: 1 -2.54,-1.27; 2 -2.54,1.27; 3 0,-1.27; 4 0,1.27; 5 2.54,-1.27; 6 2.54,1.27
1X03 = drill 1.016: 1 -2.54,0; 2 0,0; 3 2.54,0
ML16 = drill 0.914 octagon: 1 -8.89,-1.27; 2 -8.89,1.27; 3 -6.35,-1.27; 4 -6.35,1.27; 5 -3.81,-1.27; 6 -3.81,1.27; 7 -1.27,-1.27; 8 -1.27,1.27; 9 1.27,-1.27; 10 1.27,1.27; 11 3.81,-1.27; 12 3.81,1.27; 13 6.35,-1.27; 14 6.35,1.27; 15 8.89,-1.27; 16 8.89,1.27
USB-B = drill 0.95: 1 7.27,14.99; 2 4.77,14.99; 3 4.77,12.99; 4 7.27,12.99 | drill 1.6 pad 2.9: S1 -0.3,10.28; S2 12.7,10.28
J1 = drill 0.9 pad 1.3: 1 4.445,2.54; 2 3.175,0; 3 1.905,2.54; 4 0.635,0; 5 -0.635,2.54; 6 -1.905,0; 7 -3.175,2.54; 8 -4.445,0 | drill 1 pad 1.422: 9 5.465,7.37; 10 2.925,7.37; 11 -2.925,7.37; 12 -5.465,7.37 | drill 1.6 pad 2.184: M1 -8.175,-3.3; M2 8.175,-3.3 | hole 3.3: 5.715,-6.35; -5.715,-6.35
6MM_V = drill 1.016 long: A -2.54,-2.54; E 2.54,-2.54; S 0,2.54
0204/7 = drill 0.813 octagon: 1 -3.81,0; 2 3.81,0
SIL6 = drill 0.813 square: 1 -6.35,0 | drill 0.813: 2 -3.81,0; 3 -1.27,0; 4 1.27,0; 5 3.81,0; 6 6.35,0
ALPS_SCHA5B0200_MICRO_SD_PUSHPUSH = smd 0.9 x 0.45: 1 -0.062,4.675; 2 -0.062,3.975; 3 -0.062,3.275; 4 -0.062,2.575; 5 14.438,2.575; 6 14.438,3.275; 7 14.438,3.975; 8 14.438,4.675 | smd 1.1 x 1.5: 20 0,1.35; 21 14.375,1.35 | smd 0.9 x 2: 22 -0.062,12.4; 23 14.438,11.1 | smd 1.2 x 1: 24 3.763,15.3; 25 9.762,15.3 | smd 0.5 x 0.7: COMMON 1.212,14.85; SWITCH 10.963,14.85
TO92 = drill 0.813 octagon: 1 1.27,0; 2 0,1.905; 3 -1.27,0
SJ = smd 1.168 x 1.6: 1 -0.762,0; 2 0.762,0
PT-1.5/3-5.0 = drill 1.1 pad 2.54: 1 5,0; 2 0,0; 3 -5,0
MABP5S = drill 1.4: 1 -7.5,0; 3 7.5,0; 4 -5,-2.5; 5 5,-2.5; PE 5,10; PE@ -5,10 | drill 1.4 octagon: 2 0,0
MIDIBOX14X12 = drill 3.1 pad 8: P$1 5,135; P$2 50,105; P$3 70,35; P$4 5,5; P$7 115,135; P$8 115,5

### Placement (x,y rotation side)
CORE_LPC17  48.55,58.74 90 top
CR_C12  101.6,105.46 0 top
CR_C13  99.36,93.88 270 top
CR_C14  96.83,22.3 0 top
CR_C15  87.3,66.25 180 top
CR_D1  33.5,56.15 270 top
CR_D2  35.56,120.9 90 top
CR_D3  73.56,120.9 90 top
CR_D4  54.41,120.9 90 top
CR_D5  92.46,120.9 90 top
CR_IC1  86.11,50.44 270 top
CR_IC2  85.34,29.67 180 top
CR_IC4  27.84,120.29 90 top
CR_IC5  47.14,120.29 90 top
CR_IC7  99.1,120.92 270 top
CR_IC8  66.45,120.29 90 top
CR_IC9  85.14,120.29 90 top
CR_J2  94.69,79.25 90 top
CR_J4A  85.95,83.52 0 top
CR_J4B  86,95.25 0 top
CR_J5A  113.54,57.76 90 top
CR_J5B  104.04,57.71 90 top
CR_J8/9  99.92,6.45 0 top
CR_J10  26.21,79.25 90 top
CR_J11  26.21,99.77 90 top
CR_J12  17.73,133.5 180 top
CR_J13  33.17,133.5 180 top
CR_J15_S  87.27,75.18 0 top
CR_J15A  75.59,6.45 0 top
CR_J15B  75.59,16.26 0 top
CR_J16  113.54,99.01 90 top
CR_J17  17.4,38.22 180 top
CR_J18  28.52,53.66 270 top
CR_J19  113.44,37.13 90 top
CR_J20  48.62,133.5 180 top
CR_J21  64.06,133.5 180 top
CR_J22  -3,45.5 270 top
CR_J23  28.45,63.6 90 top
CR_J27  44.25,20.32 180 top
CR_J28  113.54,78.44 90 top
CR_J30  47.5,6.47 0 top
CR_LAN  14,20.5 270 top
CR_LAN_LED  28.37,42.12 270 top
CR_P1  104.65,16.66 90 top
CR_P2  95.1,16.66 90 top
CR_R1  115.92,17.54 270 top
CR_R2  113.42,22.05 270 top
CR_R3  110.9,20.81 270 top
CR_R7  86.03,77.99 0 top
CR_R8  85.99,80.25 0 top
CR_R9  86,89.81 0 top
CR_R10  86,92.05 0 top
CR_R11  24.73,49.77 180 top
CR_R12  102.67,34.59 0 top
CR_R13  102.87,25.86 270 top
CR_R18  20.73,120.9 90 top
CR_R19  20.32,110.95 270 top
CR_R20  28.04,126.8 180 top
CR_R21  37.69,120.9 270 top
CR_R22  29.67,112.17 0 top
CR_R23  39.73,120.9 90 top
CR_R24  38.81,111.56 270 top
CR_R25  49.17,126.8 180 top
CR_R26  56.69,120.9 270 top
CR_R27  48.97,112.17 0 top
CR_R28  58.93,120.9 90 top
CR_R29  57.91,111.61 270 top
CR_R30  68.28,127 180 top
CR_R31  75.79,120.9 270 top
CR_R32  68.28,112.17 0 top
CR_R33  85.34,22.35 0 top
CR_R34  78.03,120.9 90 top
CR_R35  77.01,111.61 270 top
CR_R36  87.38,126.59 180 top
CR_R37  94.69,120.9 270 top
CR_R38  87.17,112.17 0 top
CR_SDCARD  116.64,111.15 90 top
CR_T1  98.96,29.67 270 top
J42  84.73,105.05 90 top
J43  87.27,105.05 90 top
J44  83.97,98.76 180 top
KLEMME1  102.36,133.96 180 top
KLEMME2  87.22,133.96 180 top
MIDI_IN1  11.5,118.3 90 top
MIDI_IN2  11.5,78.8 90 top
MIDI_OUT1  11.5,98.6 90 top
MIDI_OUT2  11.5,59 90 top
U$2  0,0 0 top
U$5  [CORE_LPC17]  51.82,98.76 0 top
U$6  [VLRLAB]  33.32,8.53 0 bottom
U$7  [VLRLAB]  9.14,8.53 0 top
U$8  [CORE_LPC17]  100.38,75.59 90 bottom

### Tracks (layer width: path | path; a pad name or v marks a point on that pad's centre or on a via)
+3V3  (via drill 0.33)
  Top 0.406: CR_SDCARD.4 114.06,112.43 108.1,118.39 CR_IC7.OUT
  Top 1.016: CR_C13.1 97.64,96.42 96.11,97.94 v91.85,102.21 95.1,105.46 CR_C12.+ | CR_J10.2 22.76,71.98 22.76,52.43 32.92,42.27 32.92,28.85 34.79,26.99 CORE_LPC17.J6-28
  Bottom 1.016: 104.8,96.47 CR_J16.4 | CR_J16.4 CR_J16.3 CR_J16.4 | 104.8,96.47 104.75,96.42 104.75,82.45 | 104.75,82.45 104.7,82.4 | CR_J28.3 CR_J28.4 | 104.75,82.45 104.75,75.89 | 104.75,75.89 104.85,75.89 CR_J28.4 | CR_J15_S.1 80.47,75.18 79.65,75.18 77.83,77.01 77.83,100.18 79.86,102.21 v91.85,102.21 | CR_J28.4 104.75,75.89 | 104.75,75.89 104.75,72.24 108.92,68.07 108.92,55.07 111.35,52.63 | 111.35,52.63 CR_J5A.2 | CR_J5A.2 112.12,52.68 CR_J5A.2 | 90.98,112.12 CR_R38.2 90.98,112.12 | 90.98,112.12 90.98,109.93 | 90.98,109.93 93.22,109.93 99.11,109.93 99.11,106.83 | 99.11,106.83 CR_C12.+ 99.11,106.83 | CR_IC7.OUT 99.1,106.84 99.11,106.83 | 90.98,112.12 90.98,109.93 | 90.98,109.93 72.14,109.93 | 72.14,109.93 52.83,109.93 | 52.83,109.93 40.84,109.93 | 40.84,109.93 35.71,109.93 CR_R22.2 | CR_J10.2 22.76,76.35 22.76,85.95 35.97,99.36 38.61,99.36 40.84,101.8 40.84,109.93 | CR_R27.2 52.83,112.12 52.83,109.93 | CR_R32.2 72.14,112.12 72.14,109.93 | 104.8,96.47 99.42,96.47 CR_C13.1 | CR_J5B.2 102.77,52.27 104.24,50.8 109.53,50.8 111.35,52.63
+5V  (via drill 0.6)  (4 unrouted)
  Top 1.016: CR_R12.2 CR_J19.4 CR_J19.3 | KLEMME2.1 85.73,130.45 93.67,130.45 97.18,133.96 KLEMME1.1 99.1,132.22 CR_IC7.IN 97.74,123.53 96.47,122.25 96.47,121.67 96.47,115.72 96.47,110.9 95.5,109.93 94.49,108.92 89.81,104.24 CR_J4B.4 | CR_P1.A 103.94,14.12 97.54,7.72 CR_J8/9.4 CR_J8/9.3 | v47.5,12.45 20.68,12.45 18.64,14.48 18.64,38.25 CR_J17.1 18.68,47.52 CR_R11.2
  Bottom 0.813: CR_R7.2 89.86,77.98 CR_J2.1
  Bottom 1.016: 20.93,49.78 20.93,92.46 20.88,101.7 22.3,103.12 24.03,104.85 | 24.03,113.89 CR_IC4.8 23.42,117.09 CR_R18.1 | 24.03,113.89 24.03,106.48 24.03,104.85 | CR_R28.1 62.03,117.09 CR_IC8.8 62.59,116.43 62.59,113.89 | CR_IC7.IN 99.08,123.44 97.64,123.44 96.47,122.28 96.47,115.88 94.49,113.89 81.48,113.89 | 81.48,113.89 76.25,113.89 62.94,113.89 62.59,113.89 | 62.59,113.89 51.05,113.89 43.48,113.89 | 43.48,113.89 37.85,113.89 24.03,113.89 | 24.03,104.85 CR_J11.10 | CR_J11.10 24.03,104.85 | CR_J11.10 CR_J11.9 | 81.28,116.43 81.28,114.1 81.48,113.89 | CR_R34.1 80.72,117.09 CR_IC9.8 | CR_J4B.4 CR_R10.2 CR_R9.2 89.81,83.57 89.81,66.43 CR_C15.1 89.89,61.84 CR_IC1.20 98.14,53.75 106.48,45.52 106.48,34.7 CR_R12.2 104.85,32.97 104.85,27.28 104.85,16.46 CR_P1.A | CR_J4A.4 89.76,80.29 CR_R8.2 89.8,78.04 CR_R7.2 89.84,75.21 CR_J15_S.3 | 43.48,113.89 43.33,113.89 CR_IC5.8 42.72,117.09 CR_R23.1 | CR_J15B.1 66.7,14.88 64.41,12.6 64.41,12.45 | 64.41,12.45 64.41,7.52 66.7,5.23 | v47.5,12.45 64.41,12.45
+12V
  Top 1.016: KLEMME2.3 92.25,134.11 94.28,136.14 105.26,136.14 107.29,134.11 KLEMME1.3
A0
  Top 0.406: CORE_LPC17.J6-15 61.94,62.55 62.79,63.4 76.61,63.4 76.77,63.56 82.09,68.89 97.33,68.89 106.07,68.89 106.88,68.07 106.88,59.33 110.95,55.27 112.22,55.27 CR_J5A.4
A1
  Top 0.406: CORE_LPC17.J6-16 76.06,65.09 81.28,70.31 98.55,70.31 106.68,70.31 108.31,68.68 108.31,60.55 111.15,57.71 112.01,57.71 CR_J5A.6
A2
  Top 0.406: CORE_LPC17.J6-17 75.96,67.63 80.06,71.73 99.97,71.73 107.29,71.73 109.73,69.29 109.73,61.98 111.15,60.55 112.01,60.55 CR_J5A.8
A3
  Top 0.406: CORE_LPC17.J6-18 75.86,70.17 78.84,73.15 100.79,73.15 107.9,73.15 111.35,69.7 111.35,63.6 112.17,62.79 112.22,62.79 CR_J5A.10
A4  (via drill 0.33)
  Top 0.406: v84.58,58.01 96.42,58.01 99.36,55.07 102.67,55.07 CR_J5B.4
  Bottom 0.406: CORE_LPC17.J6-19 61.61,72.71 63.4,70.92 63.4,59.54 64.82,58.12 64.92,58.01 v84.58,58.01
A5  (via drill 0.33)
  Top 0.406: CORE_LPC17.J6-20 68.24,75.25 v68.25,75.26 | v69.9,59.94 70.71,59.13 79.05,59.13 80.47,60.55 96.93,60.55 99.77,57.71 CR_J5B.6
  Bottom 0.406: v68.25,75.26 69.9,73.61 v69.9,59.94
CAN
  Top 0.305: 28.55,49.78 28.55,51.82 CR_J18.2 | 28.55,49.78 CR_R11.1 28.55,49.78 | 28.55,49.78 31.09,49.78 33.33,52.02 CR_D1.A 33.73,52.43 36.98,52.43 CORE_LPC17.J6-38
CR_LEFT_LED
  Top 0.61: CR_LAN_LED.1 26.62,41.63 26.62,32.72 26.62,31.21 CR_LAN.12
CR_M1+
  Top 0.406: 18.69,126.8 CR_R20.2 18.69,126.8 | 18.69,126.8 17.27,125.37 17.27,116.81 17.27,116.57 MIDI_IN1.4 | 18.69,126.8 16.46,129.03 16.46,133.5 CR_J12.5
CR_M1-
  Top 0.406: CR_IC4.3 34.8,124.71 CR_D2.A
  Bottom 0.406: CR_J12.1 20.27,134.57 25.2,129.64 | 25.2,129.64 27.64,127.2 | 27.64,127.2 27.64,125.58 | 27.64,125.58 CR_IC4.3 | 27.64,125.58 27.64,127.2 | 27.64,127.2 25.2,129.64 | 25.2,129.64 20.11,129.64 MIDI_IN1.5
CR_M2+$1
  Top 0.406: CR_D2.C 33.58,117.09 CR_IC4.2 30.07,120.6 30.07,124.97 31.85,126.75 CR_R20.1
CR_MIDI1_RX  (via drill 0.33)
  Top 0.406: CR_R18.2 20.88,124.71 CR_IC4.6 24.03,121.46 30.28,115.21 v30.28,107.29 | CORE_LPC17.J6-43 32.51,69.69 32.51,87.58 29.46,90.63 24.99,90.63 22.76,92.86 22.76,98.75 23.77,99.77 CR_J11.6
  Bottom 0.406: CR_J11.6 26.21,100.94 26.21,102.82 26.98,103.58 28.19,103.58 30.28,105.66 v30.28,107.29
CR_MIDI1_TX
  Top 0.406: CORE_LPC17.J6-42 31.39,68.27 31.39,83.97 31.39,87.07 29.06,89.41 24.38,89.41 21.34,92.46 21.34,100.38 23.37,102.41 24.84,102.41 CR_J11.8 26.21,103.58 33.88,103.58 36.37,106.07 36.37,115.37 36.37,115.42 37.39,116.43 37.59,116.64 37.69,116.74 CR_R21.2
CR_MIDI2_RX  (via drill 0.33)
  Top 0.406: CR_R23.2 40.18,124.71 CR_IC5.6 44.7,120.19 44.7,115.42 43.28,114 40.44,114 37.39,110.95 37.39,105.66 34.34,102.62 30.07,102.62 27.48,100.03 CR_J11.5 35.56,99.77 41.05,94.28 41.05,93.67 41.05,93.07 41.05,51.41 v42.67,49.78
  Bottom 0.406: CORE_LPC17.J6-10 59.91,49.78 v42.67,49.78
CR_MIDI2_TX  (via drill 0.33)
  Top 0.406: v42.27,47.35 40.23,49.38 40.23,93.27 35,98.5 26.87,98.5 26.21,99.16 26.21,101.04 CR_J11.7 | CR_R26.2 55.07,115.47 55.07,111.15 53.44,109.53 43.89,109.53 v37.19,102.82
  Bottom 0.406: CORE_LPC17.J6-9 59.94,47.35 v42.27,47.35 | CR_J11.7 27.99,102.82 v37.19,102.82
CR_MIDI3_RX  (via drill 0.33)
  Top 0.406: CORE_LPC17.J6-22 66.04,86.39 66.04,117.45 66.04,120.09 64.57,121.56 CR_IC8.6 62.59,121.51 59.38,124.71 CR_R28.2 | v72.95,60.35 78.03,60.35 80.87,63.2 99.82,63.2 CR_J5B.8
  Bottom 0.406: CORE_LPC17.J6-22 68.82,80.33 72.95,76.2 v72.95,60.35
CR_MIDI3_TX  (via drill 0.33)
  Top 0.406: CORE_LPC17.J6-21 66.85,84.66 66.85,111.35 70.51,115.01 74.57,115.01 75.79,116.23 CR_R31.2 | v71.32,61.57 77.01,61.57 79.86,64.41 101.14,64.41 CR_J5B.10
  Bottom 0.406: CORE_LPC17.J6-21 68.31,77.79 71.32,74.78 v71.32,61.57
CR_MIDI4_RX
  Top 0.406: J42.2 84.73,120.4 83.97,121.16 83.57,121.56 CR_IC9.6 81.18,121.56 CR_R34.2
CR_MIDI4_TX
  Top 0.406: J43.2 87.33,106.02 93.07,111.76 93.07,114.45 94.69,116.08 CR_R37.2
CR_RD_N
  Bottom 0.254: CR_LAN.8 16.05,24.95 26.85,35.74 27.53,36.42 35.15,36.42 36.39,36.42 CORE_LPC17.J6-32
CR_RD_P
  Bottom 0.254: CR_LAN.7 16.54,24.71 27.2,35.38 27.74,35.92 35.15,35.92 37.74,35.92 38.41,36.58 38.41,38.4 CORE_LPC17.J6-33
CR_RIGHT_LED
  Top 0.61: CR_LAN_LED.2 28.37,22.89 28.37,22.03 CR_LAN.9
CR_TD_N
  Bottom 0.254: CR_LAN.2 14,15.78 13.51,15.29 12.6,15.29 12.5,15.29 11.96,15.83 11.63,16.16 11.63,25.5 12.98,26.85 24.08,37.95 30.68,37.95 31.4,37.95 34.52,41.07 35.96,41.07 CORE_LPC17.J6-34
CR_TD_P
  Bottom 0.254: CR_LAN.1 14.99,16.05 13.72,14.78 12.6,14.78 12.29,14.78 11.61,15.47 11.12,15.95 11.12,25.71 12.62,27.2 23.87,38.46 30.68,38.46 31.19,38.46 34.16,41.43 34.16,41.81 CORE_LPC17.J6-35
D0
  Bottom 0.406: CR_J10.3 36.56,67.63 CORE_LPC17.J6-44
D1
  Bottom 0.406: CR_J10.4 26.21,77.98 28.4,77.98 36.21,70.17 CORE_LPC17.J6-45
D2
  Bottom 0.406: CR_J10.5 28.65,79.25 28.85,79.25 29.06,79.25 29.26,79.25 35.8,72.71 CORE_LPC17.J6-46
D3
  Bottom 0.406: CR_J10.6 26.21,80.52 28.4,80.52 30.07,80.52 30.23,80.52 35.5,75.25 CORE_LPC17.J6-47
D4
  Bottom 0.406: CR_J10.7 31.34,81.79 35.35,77.79 CORE_LPC17.J6-48
D5
  Bottom 0.406: CR_J10.8 26.21,83.06 28.45,83.06 32.41,83.06 35.14,80.33 CORE_LPC17.J6-49
D6
  Bottom 0.406: CR_J10.9 33.33,84.33 34.79,82.87 CORE_LPC17.J6-50
D7  (via drill 0.33)
  Top 0.406: CORE_LPC17.PAD1 42.54,95.23 v41.25,96.52
  Bottom 0.406: v41.25,96.52 40.23,96.52 38.61,94.89 35.51,94.89 CR_J10.10
DISP_RC-O  (via drill 0.33, 0.6)
  Top 0.406: CORE_LPC17.PAD9 47.55,87.89 47.55,28.45 52.58,23.42 v55.42,20.52 | CR_IC2.12 83.97,25.86 82.7,24.59 77.42,24.59 76.4,23.57 v76.4,20.52
  Bottom 0.406: v76.4,20.52 60.76,20.52 57.1,20.52 v55.42,20.52
DISP_SC  (via drill 0.33)
  Top 0.406: 50.44,23.82 v50.55,23.72 46.33,27.94 46.33,89.2 47.6,90.48 CORE_LPC17.PAD8
  Bottom 0.406: v50.55,23.72 50.6,23.77 74.4,23.77 76.81,23.77 77.67,24.64 77.67,26.62 77.67,26.67 78.23,27.23 80.16,27.23 80.21,27.18 CR_IC2.11
GND  (via drill 0.33)
  other vias: 45.11,85.14 42.42,36.32 45.09,53.98 45.09,61.98
  pour Bottom: 0,140 120.09,140 120.09,0 0,0
  pour Top: 120.09,140 120.09,0 0,0 0,140
IIC1_SC
  Top 0.406: CR_R7.1 81.33,77.97 79.65,79.65 | 79.65,79.65 81.48,81.48 83.52,81.48 84.68,82.65 CR_J4A.2 | CORE_LPC17.J6-25 58.52,86.49 58.52,74.57 59.13,73.97 60.76,73.97 61.16,73.97 73.97,73.97 79.65,79.65
IIC1_SD
  Top 0.406: CR_R8.1 87.2,80.25 | 87.2,80.25 CR_J4A.3 | CORE_LPC17.J6-26 57.84,88.42 57.84,72.62 59.03,71.42 60.86,71.42 60.96,71.53 74.57,71.53 79.86,76.81 83.46,76.81 83.76,76.81 87.2,80.25
IIC2_SC  (via drill 0.33)
  Top 0.406: CR_J4B.2 84.73,95.3 J44.1 84.73,101.3 84.73,104.44 | v64.06,76.56 67.67,80.16 67.67,100.38 67.67,103.63 68.48,104.44 84.73,104.44 | J42.1 84.73,104.44
  Bottom 0.406: CORE_LPC17.J6-41 53.62,76.5 53.67,76.56 v64.06,76.56
IIC2_SD  (via drill 0.33)
  Top 0.406: v66.85,76.81 69.09,79.05 69.09,89.41 69.49,89.81 CR_R9.1 83.26,89.81 87.17,93.73 CR_J4B.3 87.27,102.26 J43.1
  Bottom 0.406: CORE_LPC17.J6-40 53.62,73.97 64.01,73.97 v66.85,76.81
J15A-E  (via drill 0.33)
  Top 0.406: CORE_LPC17.PAD12 50.14,30.27 50.14,30.12 v54.05,26.21 | CR_J15A.12 83.21,11.53 83.21,18.6 84.12,19.51 88.59,19.51 91.28,22.19 CR_R33.6
  Bottom 0.406: v54.05,26.21 55.07,25.2 71.53,25.2 75.39,29.06 88.19,29.06 90.42,26.82 90.42,23.62 CR_R33.6
J15B-E2  (via drill 0.33)
  Top 0.406: CR_J15B.12 79.4,17.58 79.4,18.39 79.55,18.39 83.52,22.35 CR_R33.3 | CORE_LPC17.PAD13 53.95,91.76 53.95,31.9 58.12,27.74 58.12,21.74 60.96,18.9 | 60.96,18.9 v62.18,18.9 | 60.96,18.9 60.96,5.08 59.74,3.86 51.38,3.86 CR_J30.7
  Bottom 0.406: v62.18,18.9 78.03,18.9 79.02,17.91 79.07,17.91 79.4,17.58 CR_J15B.12
LCD_VOLTAGE_OPTION
  Top 1.016: CR_J30.3 CR_J30.4
  Bottom 1.016: CR_J15_S.2 87.27,39.88 87.27,39.73 87.27,38.51 89,36.78 93.67,36.78 96.11,34.34 96.11,27.74 CR_IC2.16 94.23,22.76 CR_C14.1 94.29,17.27 CR_P2.A 97.54,14.02 87.99,14.02 | CR_IC2.10 CR_R33.1 | CR_R33.1 78.99,21.18 80.06,20.12 81.89,20.12 CR_J15B.16 87.99,14.02 | 87.99,14.02 87.99,11.23 CR_J15A.16 | CR_R33.1 78.79,22.55 51,22.55 44.96,16.51 44.96,16.41 CR_J30.4
MCLK  (via drill 0.33)
  Top 0.406: v71.73,88.59 110.13,88.59 114.81,83.92 CR_J28.9
  Bottom 0.406: CORE_LPC17.PAD16 57.7,95.5 61.57,95.5 68.48,88.59 v71.73,88.59
MF_M+ZULEITUNG
  Bottom 0.406: CR_R25.2 35.97,126.8 31.9,130.86 31.9,132.89 30.63,134.16 CR_J13.5 29.26,136.14 14.63,136.14 9.96,131.47 8.13,129.64 8.13,78.23 8.13,76.45 10.78,73.8 MIDI_IN2.4
MF_M+ZULEITUNG1
  Bottom 0.406: CR_J20.5 47.35,133.5 47.35,131.67 49.58,129.44 55.47,129.44 57.91,127 CR_R30.2
MF_M+ZULEITUNG2
  Bottom 0.406: CR_J21.5 62.79,133.5 62.79,131.67 64.21,130.25 65.43,130.25 74.37,130.25 78.03,126.59 CR_R36.2
MF_M-ZULEITUNG
  Top 0.406: CR_IC5.3 54.1,124.71 CR_D4.A
  Bottom 0.406: CR_J13.1 42.06,128.42 45.92,128.42 47.95,126.39 47.95,123.34 49.73,121.56 | 49.73,121.56 CR_IC5.3 | 49.73,121.56 48.46,120.29 21.34,120.29 18.69,117.65 18.69,88.59 18.69,85.67 16.82,83.8 MIDI_IN2.5
MF_M-ZULEITUNG1
  Top 0.406: CR_IC8.3 73.41,124.71 CR_D3.A
  Bottom 0.406: CR_J20.1 55.27,130.66 56.49,130.66 58.52,128.63 65.63,128.63 66.65,127.61 66.65,125.17 CR_IC8.3
MF_M-ZULEITUNG2
  Top 0.406: CR_IC9.3 92.1,124.71 CR_D5.A
  Bottom 0.406: CR_J21.1 70.1,131.27 74.57,131.27 75.39,131.27 77.62,129.03 77.83,129.03 83.92,129.03 86.16,126.8 86.16,124.16 88.75,121.56 CR_IC9.3
N$1
  Top 0.406: CR_J15A.3 69.19,5.23 67.97,6.45 67.97,13.72 CR_J15B.3 70.51,16.26 70.51,18.29 | 70.51,18.49 70.51,18.29 | CR_IC2.6 79.35,31.29 73.97,31.29 70.51,27.84 70.51,18.29
N$2
  Top 0.406: 71.78,18.64 CR_J15B.6 71.78,18.64 | CR_IC2.5 81.08,30.48 74.37,30.48 71.37,27.48 71.37,19.05 71.78,18.64
  Bottom 0.406: CR_J15B.6 70.51,16.26 70.51,8.94 CR_J15A.6
N$3
  Top 0.406: CR_J15A.5 71.73,5.28 70.51,6.5 70.51,13.72 CR_J15B.5 73.05,16.26 73.05,18.59 72.24,19.41 72.24,27.13 74.78,29.67 82.8,29.67 CR_IC2.4
N$4
  Top 0.406: CR_IC2.3 84.53,28.85 75.18,28.85 73.1,26.77 73.1,19.76 74.37,18.49 74.37,17.58 CR_J15B.8
  Bottom 0.406: CR_J15B.8 73,16.2 73,8.99 CR_J15A.8
N$5
  Top 0.406: CR_J12.6 15.19,127.15 10.77,122.73 8.89,120.85 8.89,108.46 | 14,93.7 MIDI_OUT1.4 11.05,93.6 8.89,95.76 8.89,108.46 | CR_R22.1 25.7,112.01 17.53,112.01 13.97,108.46 8.89,108.46
N$6
  Top 0.305: CR_D1.C 33.73,59.74 34.95,58.52 34.95,56.49 36.98,54.46 37.39,54.86 CORE_LPC17.J6-39
N$7
  Top 0.406: CR_R19.1 21.69,114.76 22.55,115.62 22.55,117.55 CR_IC4.7
N$8
  Top 0.406: CR_J15A.7 74.22,5.18 73,6.4 73,13.66 CR_J15B.7 75.59,16.26 75.59,18.49 75.59,18.69 73.97,20.32 73.97,26.42 75.59,28.04 86.26,28.04 CR_IC2.2
N$9
  Top 0.406: 76.86,18.44 76.86,18.49 | 76.86,18.49 76.86,18.44 | 76.86,18.44 CR_J15B.10 | CR_IC2.1 87.99,27.23 76,27.23 74.78,26.01 74.78,20.73 76.86,18.64 76.86,18.49
  Bottom 0.406: CR_J15B.10 75.59,16.26 75.59,8.94 CR_J15A.10
N$10
  Top 0.406: CR_J15A.9 76.76,5.18 75.59,6.35 75.59,13.72 CR_J15B.9 78.13,16.26 78.13,18.54 78.13,19.41 77.42,20.12 77.42,22.96 78.23,23.77 89.61,23.77 CR_IC2.15
N$11
  Bottom 0.406: CORE_LPC17.J6-51 39.83,82.69 39.83,65.23 38.41,63.8 29.87,63.8 28.45,62.38 CR_J23.1
N$12
  Top 0.406: CR_P2.S 89.92,16.66 83.21,9.96 83.21,6.45 CR_J15A.13
  Bottom 0.406: CR_J15B.13 83.21,13.72 83.21,6.45 CR_J15A.13
N$13
  Top 0.406: CR_IC1.15 93.07,49.17 99.16,43.08 105.05,37.19 110.69,37.19 110.74,37.19 112.12,37.19 CR_J19.6
N$14
  Bottom 0.813: CR_P1.S 102.87,17.32 CR_R13.2
N$15
  Bottom 1.016: CR_R13.1 CR_T1.2
N$18
  Top 0.813: CR_T1.3 98.96,30.89 CR_T1.3 | CR_T1.3 98.96,34.59
  Top 1.016: 98.96,34.59 CR_R12.1 | 98.96,34.59 98.55,35.15 77.62,35.15 72.34,40.44 67.87,40.44 62.99,35.56 62.99,21.34 66.7,17.63 CR_J15B.2 64.41,15.24 64.41,10.01 CR_J15A.2 | 98.96,34.59 CR_T1.3
N$19
  Top 0.406: CR_D4.C 52.88,117.09 CR_IC5.2 49.78,120.19 49.78,125.17 51.41,126.8 CR_R25.1
N$20
  Top 0.406: CR_IC1.17 92.67,54.25 104.7,42.22 CR_J19.10
N$21
  Top 0.406: CR_IC1.18 92.36,56.79 105.26,43.89 112.98,43.89 113.03,43.89 114.1,43.89 114.71,43.28 CR_J19.9
N$22
  Top 0.406: 112.12,39.73 CR_J19.8 | CR_J19.8 CR_J19.7 | CR_IC1.16 92.97,51.71 105.05,39.62 112.12,39.62 CR_J19.8
N$23
  Top 0.406: CORE_LPC17.J6-12 60.49,54.93 61.98,53.44 62.18,53.24 62.48,52.93 83.82,52.93 88.8,47.95 88.9,47.85 92.86,47.85 100.18,40.54 104.65,36.07 104.85,35.87 113.44,35.87 CR_J19.5
N$25
  Top 0.406: CR_R27.1 45.97,112.98 45.97,123.5 42.88,126.59 38.61,126.59 34.54,130.45 32.21,130.45 CR_J13.6 30.63,132.33 26.82,136.14 14.63,136.14 9.96,131.47 8.13,129.64 8.13,72.39 8.13,71.63 10.92,68.83 13.97,68.83 16.76,66.04 16.76,63.75 16.76,56.9 14,54.13 MIDI_OUT2.4
N$26
  Top 0.406: CR_R26.1 56.69,124.97 53.65,128.02 39.93,128.02 CR_J13.2 34.44,133.5 34.44,135.43 32.92,136.96 14.22,136.96 7.87,130.61 7.11,129.84 7.11,66.55 9.66,64 MIDI_OUT2.5
N$27
  Bottom 0.406: CORE_LPC17.PAD5 43.79,91.76 43.79,94.18 48.56,98.96 53.65,98.96 60.6,105.92 93.88,105.92 97.38,102.41 108.1,102.41 111.35,105.66 113.18,105.66 114.76,104.09 CR_J16.9
N$28
  Top 0.406: CR_D3.C 72.19,117.09 CR_IC8.2 68.83,120.45 68.83,124.66 71.17,127 CR_R30.1
N$29
  Top 0.406: CR_R29.1 59.03,115.42 CR_IC8.7
N$30
  Top 0.406: CR_J20.6 49.28,129.03 54.66,129.03 57.3,126.39 57.81,125.88 57.81,121.92 59.44,120.29 63.8,120.29 64.47,119.63 CR_R32.1
N$31
  Top 0.406: CR_J20.2 53.34,130.05 55.07,130.05 56.08,130.05 57.51,128.63 72.54,128.63 75.79,125.37 CR_R31.1
N$32
  Top 0.406: CR_D5.C 90.88,117.09 CR_IC9.2 87.33,120.65 87.33,124.46 89.46,126.59 CR_R36.1
N$33
  Top 0.406: CR_R35.1 78.23,115.42 81.33,118.52 CR_IC9.7
N$34
  Top 0.406: CR_J21.6 64.11,129.64 73.76,129.64 76.91,126.49 76.91,122.07 78.69,120.29 81.08,120.29 82.09,120.29 83.36,119.02 CR_R38.1
N$35
  Top 0.406: CR_J21.2 68.17,130.66 74.98,130.66 77.22,128.42 91.44,128.42 94.69,125.17 CR_R37.1
N$36
  Top 0.406: CR_R10.1 80.67,92.05 79.05,93.67 79.05,97.13 80.67,98.75 J44.2
N$37
  Top 0.813: CR_J22.1 CR_J17.2
N$67  (via drill 0.33)
  Top 0.406: CORE_LPC17.PAD2 43.84,89.17 v43.84,41.4 | CR_IC2.7 77.62,32.11 73.97,32.11 73.56,32.11 69.24,27.79 CR_J15B.4
  Bottom 0.406: CR_J15B.4 67.97,16.26 67.97,8.99 69.19,7.77 CR_J15A.4 | v43.84,41.4 57,28.25 61.77,28.25 68.28,28.25 68.68,28.25 69.7,28.25 73.36,31.9 73.56,32.11 77.22,32.11 77.62,32.11 CR_IC2.7
N$81
  Top 0.406: CR_R21.1 37.69,125.07 37.59,125.17 33.78,129.03 23.57,129.03 20.37,132.23 CR_J12.2
  Bottom 0.406: CR_J12.2 10.77,122.73 8.89,120.85 8.89,105.41 10.7,103.6 MIDI_OUT1.5
N$89
  Top 0.406: CORE_LPC17.J6-14 63.2,56.79 CR_IC1.3
N$90
  Bottom 0.406: CORE_LPC17.J6-23 73.15,82.91 74.57,81.48 74.57,78.63 74.57,60.96 76.28,59.33 CR_IC1.2
N$91
  Top 0.406: CORE_LPC17.J6-13 63.2,54.25 CR_IC1.4
N$92
  Top 0.406: CORE_LPC17.J6-11 60.89,52.39 61.37,51.92 80.52,51.92 82.19,51.92 82.39,51.71 CR_IC1.5
N$94
  Top 0.406: CORE_LPC17.J6-8 63.66,44.77 65.58,46.69 81.98,46.69 CR_IC1.7
N$95
  Top 0.406: CORE_LPC17.J6-7 63.56,42.23 65.43,44.09 75.18,44.09 CR_IC1.8
N$96
  Bottom 0.406: CR_IC1.9 76.72,41.55 64.38,41.55 CORE_LPC17.J6-5
N$99
  Top 0.406: CR_R24.1 39.67,115.37 CR_IC5.7
P1.20
  Top 0.406: CR_J16.7 117.45,104.19 117.45,113.59 114.06,116.98 CR_SDCARD.5
  Bottom 0.406: 42.58,87.95 CORE_LPC17.PAD3 42.51,87.95 41.05,89.41 41.05,93.67 42.06,94.69 47.35,99.97 53.03,99.97 59.74,106.68 94.49,106.68 97.74,103.43 107.49,103.43 110.74,106.68 114.2,106.68 116.23,104.65 116.23,102.97 CR_J16.7 CR_J16.8
P1.21
  Top 0.406: CR_SDCARD.2 112.66,104.48 CR_J16.10
  Bottom 0.406: CORE_LPC17.PAD4 45.08,93 45.11,93.57 49.48,97.94 54.25,97.94 61.52,105.21 93.22,105.21 96.83,101.6 109.32,101.6 111.81,104.09 CR_J16.10
P1.23
  Top 0.406: CR_J16.5 113.64,100.18 113.59,100.18 113.59,105.05 114.08,105.55 116.69,108.15 116.69,112.93 112.66,116.95 CR_SDCARD.7
  Bottom 0.406: CORE_LPC17.PAD6 46.32,89.2 48.16,89.2 48.87,89.92 48.87,91.03 49.58,91.75 50.75,91.75 51.41,92.41 51.41,93.62 53.7,95.91 55.47,95.91 63.2,103.63 92.05,103.63 95.71,99.97 108.92,99.97 111.15,97.74 113.59,97.74 114.81,98.96 CR_J16.5
P1.24
  Top 0.406: CR_SDCARD.3 113.36,111.78 111.76,113.39 109.93,113.39 109.32,112.78 109.32,100.79 110.95,99.16 112.12,99.16 CR_J16.6
  Bottom 0.406: CORE_LPC17.PAD7 47.6,93.01 47.75,94.08 50.6,96.93 54.86,96.93 62.43,104.5 92.51,104.5 96.22,100.79 109.32,100.79 111.1,99.01 CR_J16.6
P3.26  (via drill 0.33)
  Top 0.406: CR_IC1.6 80.36,51.1 58.88,51.1 55.47,54.51 v55.47,81.69
  Bottom 0.406: v55.47,81.69 53.95,83.21 53.95,89.2 52.68,90.47 CORE_LPC17.PAD14
RC-I
  Bottom 0.406: CR_R2.2 113.42,14.26 110.13,10.97 108.25,10.97 CR_J8/9.10
RC-I-
  Top 0.406: CR_R2.1 92.66,46.63 CR_IC1.14
RC-J28  (via drill 0.33)
  Top 0.406: v73,87.48 108.2,87.48 112.17,83.52 CR_J28.10 | CR_J30.10 52.58,19.97 51.82,20.73 39.83,32.72 39.42,33.12 39.42,88.18 CORE_LPC17.J6-53
  Bottom 0.406: CORE_LPC17.J6-53 47.34,80.47 55.47,80.47 56.69,81.69 56.69,85.55 57.81,86.67 72.19,86.67 v73,87.48
RC-O
  Bottom 0.406: CR_J8/9.9 109.37,9.55 111.35,9.55 115.53,13.73 CR_R1.2
RC-O-
  Top 0.406: CR_R1.1 93.19,44.09 CR_IC1.13
RS/BOOTHOLD/D1  (via drill 0.33)  (1 unrouted)
  Top 0.406: CORE_LPC17.PAD10 51.41,91.76 51.41,76.61 51.41,31.5 v54.86,28.04 57.35,25.55 57.35,8.35 54.25,5.28 52.66,5.28 CR_J30.9 | CR_J15A.11 78.08,6.45 78.08,13.66 CR_J15B.11 79.45,14.99 80.67,16.2 80.67,18.5 80.68,18.5 83.31,21.13 85.39,21.13 CR_R33.4
  Bottom 0.406: 78.03,3.86 65.84,3.86 53.92,3.86 CR_J30.9 | 78.03,3.86 78.08,3.86 78.03,3.86 | 78.03,3.86 78.23,4.01 CR_J15A.11 | 54.81,28.04 46.53,28.04 45.52,27.03 CR_J27.1 | CR_IC2.13 CR_R33.4
RS/DISP_SERIAL/DC
  Top 0.406: CORE_LPC17.PAD11 50.14,90.48 48.87,89.2 48.87,29.11 56.49,21.49 56.49,9.75 53.24,6.5 50.6,6.5 48.8,6.5 CR_J30.5 49.65,3.05 64.82,3.05 79.25,3.05 80.67,4.47 80.67,6.45 CR_J15A.14 | CR_J15B.14 81.94,18.65 81.94,18.75 83.52,20.32 87.12,20.32 CR_R33.5
  Bottom 0.406: CR_J15B.14 80.67,16.26 80.67,8.94 CR_J15A.14 | CR_IC2.14 CR_R33.5
SC
  Bottom 0.406: CR_R3.2 110.9,14.59 108.71,12.39 107.14,12.39 CR_J8/9.8
  Bottom 0.813: CR_J8/9.8 CR_J8/9.7
SC-
  Top 0.406: CR_IC1.12 90.82,41.55 94.69,41.55 110.9,25.34 CR_R3.1
SC-J28  (via drill 0.33)
  Top 0.305: 114.76,81.03 CR_J28.7
  Top 0.406: v74.98,86.56 83.11,86.56 106.68,86.56 CR_J28.8 114.3,80.97 114.76,81.03 | CR_J30.8 50.04,20.68 38.81,31.9 38.61,32.11 38.61,86.45 CORE_LPC17.J6-52
  Bottom 0.406: CORE_LPC17.J6-52 45.41,79.65 56.29,79.65 57.71,81.08 57.71,82.3 57.71,83.31 58.52,84.12 72.54,84.12 v74.98,86.56
SDA-J28  (via drill 0.33)
  Top 0.406: v70.1,87.58 71.98,85.7 104.9,85.7 112.17,78.44 CR_J28.6 | v57.02,71.04 57.02,90.07 CORE_LPC17.J6-27
  Bottom 0.406: CORE_LPC17.J6-27 65.42,87.58 v70.1,87.58 | v57.02,71.04 39.22,53.24 39.22,23.72 39.22,8.74 41.45,6.5 46.13,6.5 47.37,7.74 CR_J30.6
SI-INPUT/J1
  Top 0.406: CORE_LPC17.J6-6 64.48,39.69 67.26,42.47 72.75,42.47 78.44,36.78 78.64,36.58 98.65,36.58 107.49,27.74 109.42,25.81 109.42,12.8 108.61,11.99 104.24,11.99 101.19,8.94 101.19,6.5 99.92,5.23 CR_J8/9.5
SO-INPUT/J1
  Bottom 0.406: CR_IC1.11 90.03,39.01 93.88,39.01 97.54,35.36 97.54,22.15 99.97,19.71 99.97,7.77 CR_J8/9.6
USB_N
  Bottom 0.254: CR_J22.2 11.99,41.5 11.43,42.06 11.43,42.47 11.43,42.77 14.2,45.54 15.14,46.48 30.28,46.48 31.8,46.48 33.5,48.18 33.71,48.18 33.73,48.16 36.26,48.16 CORE_LPC17.J6-36
USB_P
  Bottom 0.254: CR_J22.3 9.99,41.13 10.92,42.06 10.92,42.47 10.92,42.98 13.84,45.9 14.93,46.99 30.28,46.99 31.59,46.99 33.15,48.54 33.55,48.95 36.22,48.95 CORE_LPC17.J6-37

### Text on the board
tPlace: replace with 1k for MIDI4 usage.
tNames: <-IN | <-OUT | 5V | GND | 12V | 5V | GND | 12V | 5V | SPI, SD or | MO2 | MI2 | GND | D6 | D4 | GND | D2 | 5V | D0 | A5 | 3V3 | 5V | A4 | GND | GND | A7 | A6 | A5 | A4 | 3V3 | LED-G | LED-Y | LAN-LED
bNames: + | + | + | + | - | - | - | - | IN-> | + | + | + | + | OUT-> | 12V | 5V | GND | 12V | - | - | - | 5V | GND | - | MIDI_IN1 | 5V | - | GND | CR_IC4 / M1 | CR_IC5 / M2 | CR_IC8 / M3 | CR_IC9 / M4 | 3V3 | + | 3V3 | MIDI_OUT1 | RC1 | 5V | MO2 | SC | RC2 | - | MO1 | SC | MI2 | SO | MI1 | GND | 3V3 | SI | + | GND | GND | MI4 | IIC2_SC | MO4 | IIC2_SD | 5V | GND | P1.18 | P1.21 | P1.24 | P1.27 | P3.25 | P4.29 | IIC2 | GND | 3V3 | GND | GND | P2.13 | GND | P2.12 | P0.28 | P2.11 | P2.10 | P0.27 | P1.20 | P1.23 | P1.26 | P1.29 | P4.28 | MIDI_IN2 | P0.22 | GND | IIC1_SC | IIC1_SD | 5V | WS | D7 | D6 | P2.9 | - | P2.8 | IIC1 | P0.21 | SC | MCLK | D5 | D4 | P2.7 | P0.3 | SDA | SC | D3 | D2 | P2.6 | + | P0.2 | 3V3 | D1 | D0 | P2.5 | A5 | P1.31 | 3V3 | 5V | GND | 3V3 | A4 | 3V3 | GND | P2.4 | GND | P1.30 | GND | P2.3 | P0.26 | P2.2 | P0.25 | MIDI_OUT2 | P2.1 | P0.24 | A7 | A0 | - | P2.0 | NMI | P0.23 | GND | A6 | A1 | 5V | P0.11 | P0.16 | A0 | OE# | A5 | A2 | P0.10 | + | P0.15 | A1 | Y0 | A4 | GND | A3 | GND | P0.5 | A2 | P0.17 | Y1 | 3V3 | 3V3 | 3V3 | P0.4 | CAN | P0.18 | A3 | Y2 | CR_IC1 | D+ | A4 | P0.1 | Y3 | D- | P0.0 | A5 | Y4 | CR_USB | TD+ | A6 | LED-G | P0.6 | Y5 | RC1 | TD- | P0.7 | A7 | LED-Y | Y6 | SC | RC2 | RD+ | GND | P0.8 | Y7 | SC | RD- | SO | P0.9 | USB-POWER | SI | NC | 5V | RESET_N | 5V | NC | GND | Q7 | Q6 | Q5 | Q4 | Q3 | Q2 | Q1 | GND | VB | NC | GND | EXT_POWX | CR_IC2 | 3V3 | Q8 | CLR# | SCLK | RCLK | OE# | SER | Q0 | VDD | GNDX | D7 | D5 | D3 | D1 | E | RS | LCD-VD | Lum | D6 | D4 | D2 | D0 | RW | V0 | GND | 5V | D7 | D5 | D3 | D1 | E | RS | LCD-VD | GND | LCD-VD | SDA | SC | RC | Lum | GND | 5V | SO | SC | RC1 | D6 | D4 | D2 | D0 | RW | V0 | GND | GND | 5V | SI | SC | RC2 | DC | D0 | D1 | 5V